# EAGLE board pcDuino3c_MB (EAGLE 7.2.0), part 1 of 2
pcDuino3C Base Board
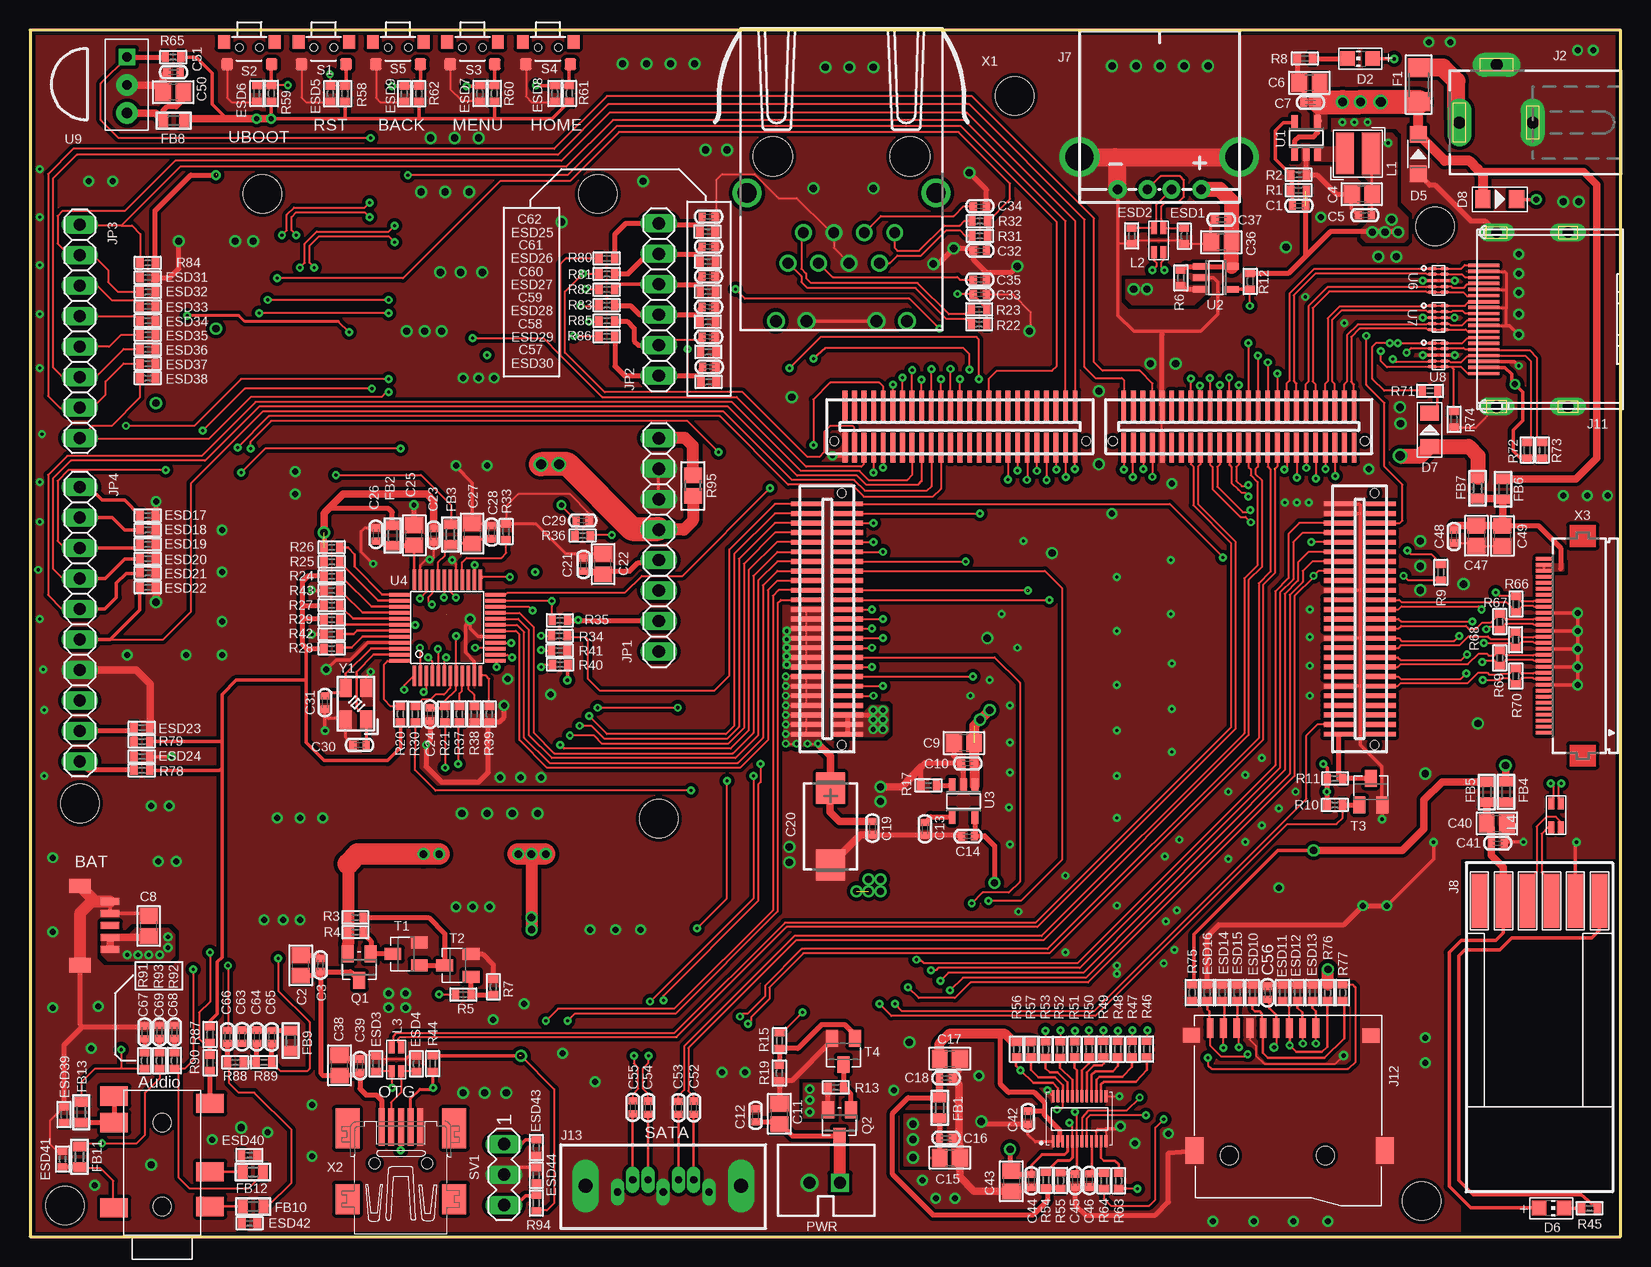
[diagram p8: board, top side]
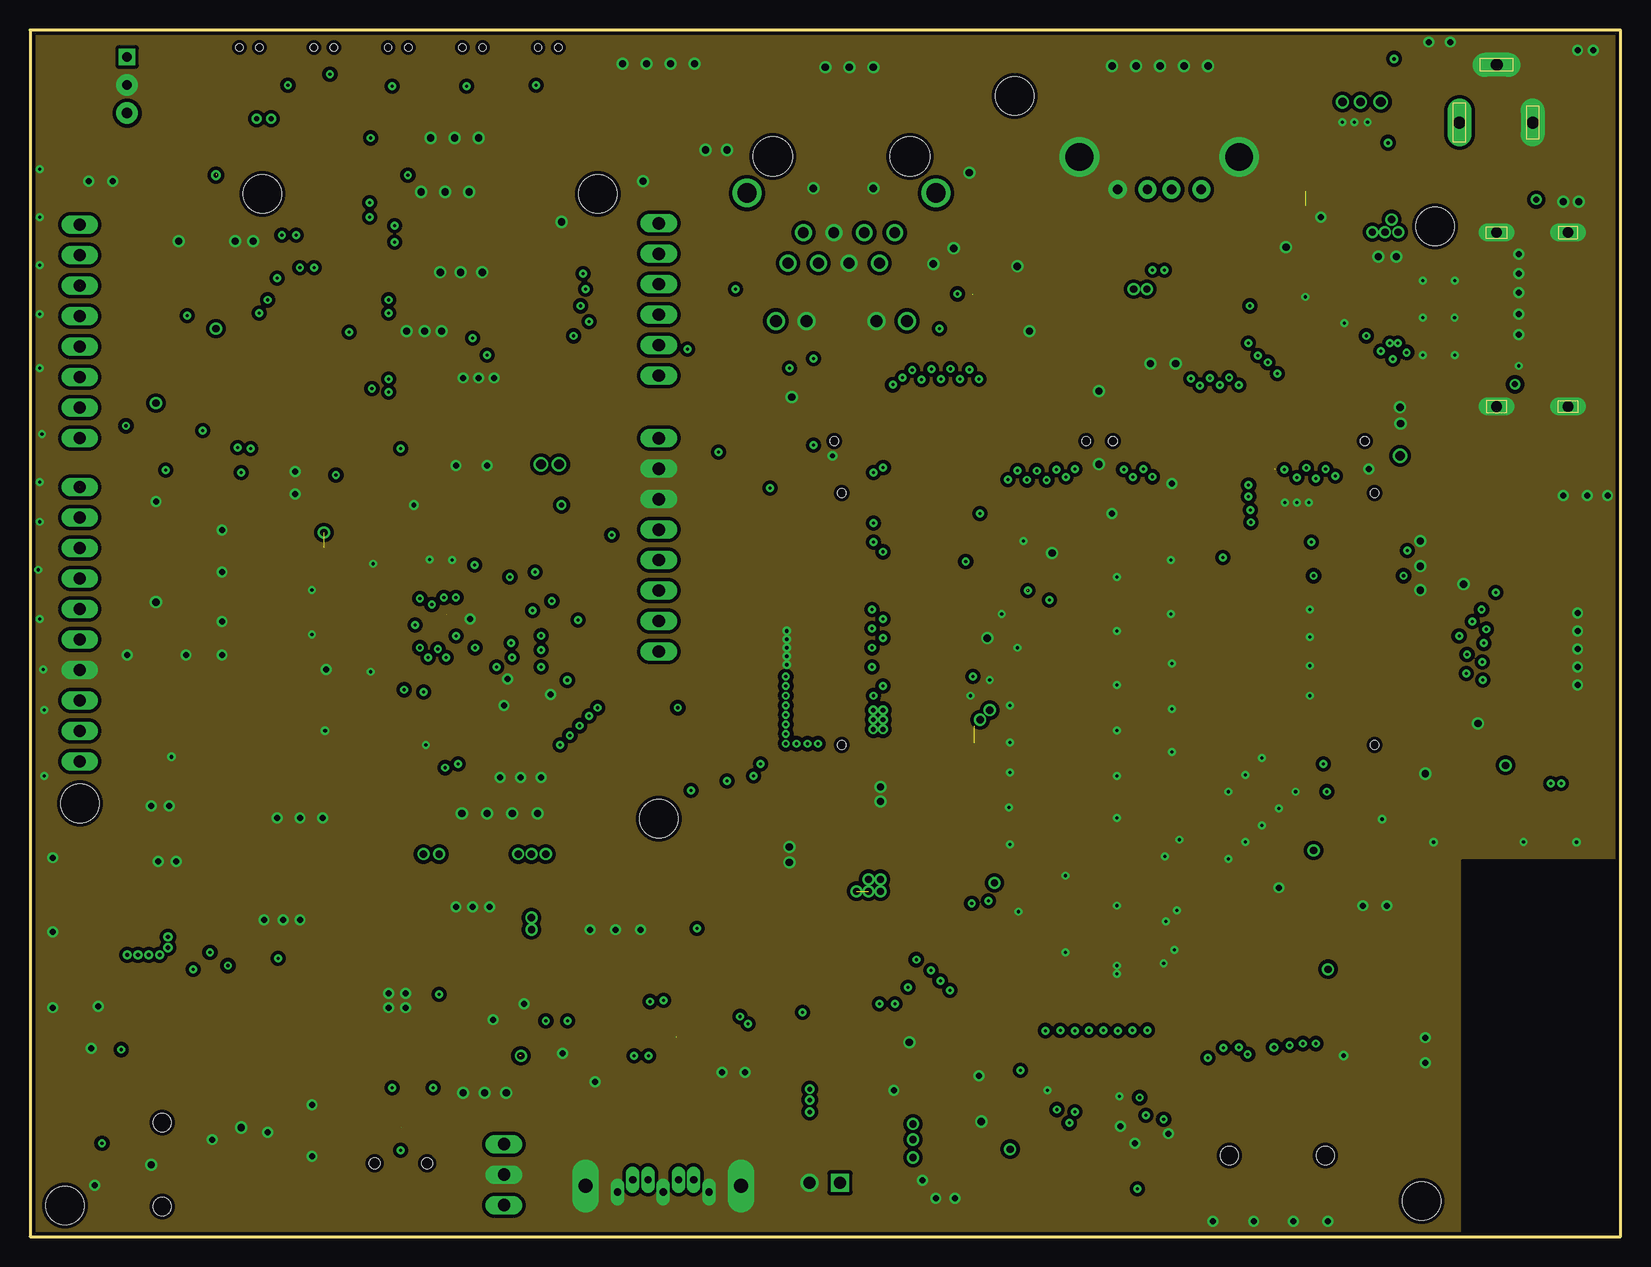
[diagram p9: board, inner layer GND]
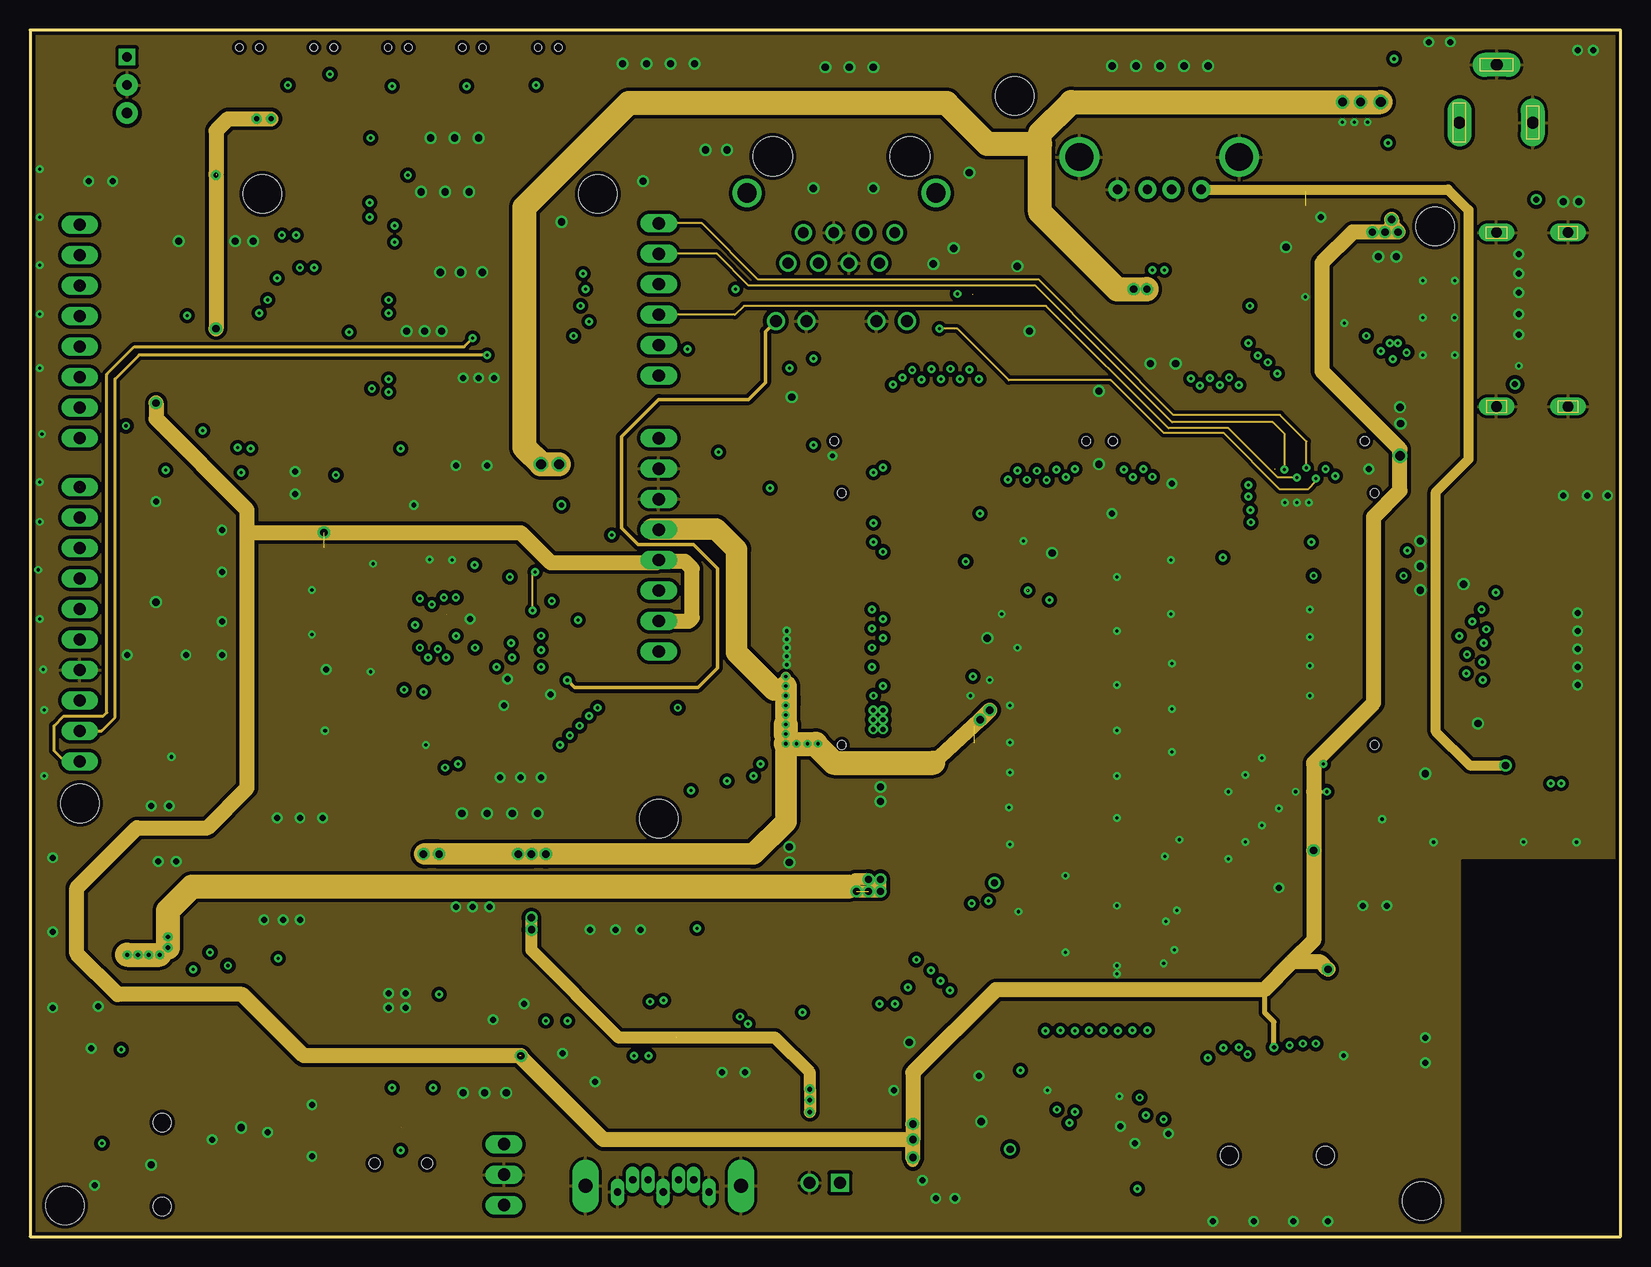
[diagram p10: board, inner layer VCC]
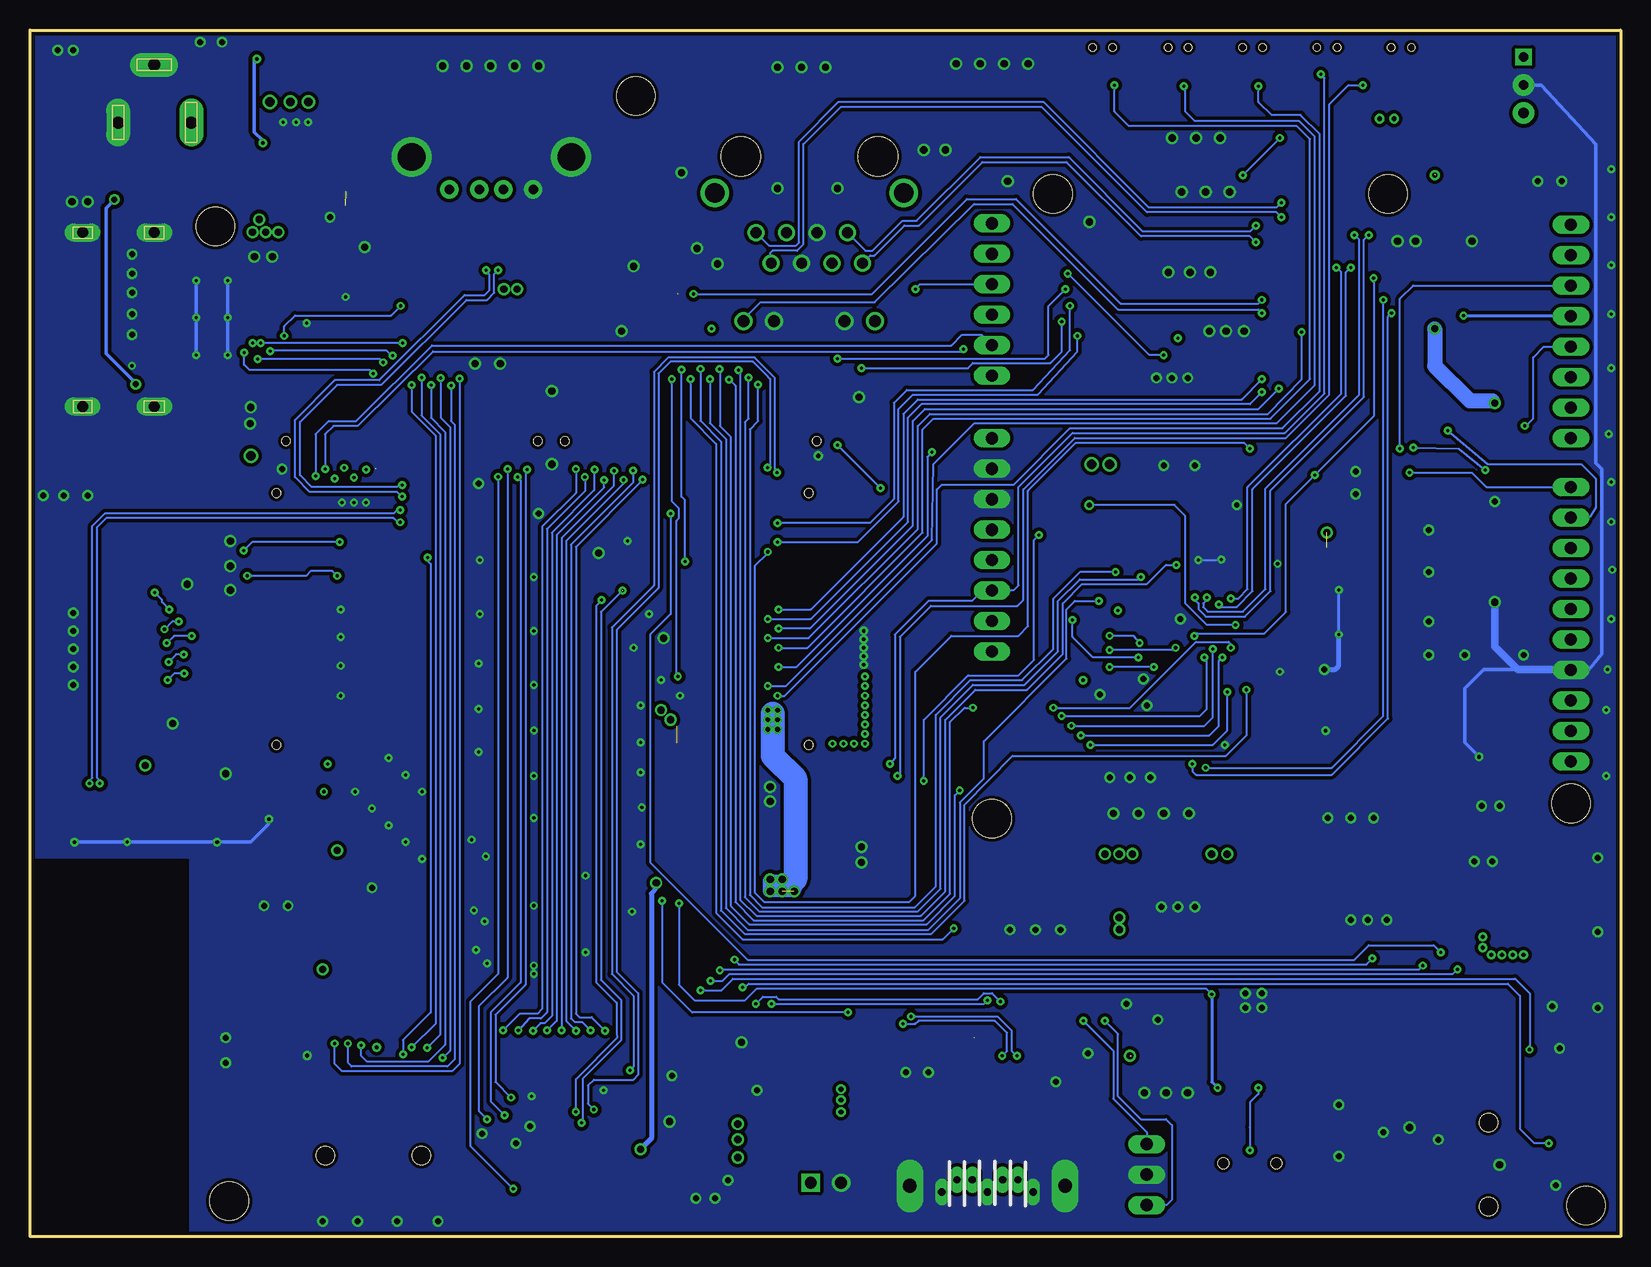
[diagram p11: board, bottom side, seen from below]

Size 132.6 x 100.6 mm. Coordinates in mm from the lower left corner, seen from the top.
Outline: 0,0 132.6,0 132.6,100.6 0,100.6 0,0
Copper layers (1+2*3+16): Top 0.035mm / dielectric 1.5mm / GND 0.035mm / dielectric 0.15mm / VCC 0.035mm / dielectric 0.2mm / Bottom 0.035mm
Design rules "default *": minimum track width 0.15mm, minimum drill 10mil, track to track 4mil, track to pad 4mil, pad to pad 4mil, via to via 4mil, smd to smd 0mil, copper to edge 5mil, drill to drill 5mil, minimum pad ring 10mil, minimum via ring 8mil, stop-mask expansion 1mil, vias tented up to drill 10mil, thermal gap 10mil
Net classes: 0 default: clearance 0.205 mm; 1 GND: width 0.406 mm, drill 0.61 mm, clearance 0.203 mm to class 0; 2 DC_5V: width 0.406 mm, drill 0.61 mm, clearance 0.203 mm to class 0, clearance 0.203 mm to class 1
Holes 3.2 mm at 19.39,86.92 47.33,86.92 4.15,36.12 52.41,34.85 2.9,2.6 82.09,95.09 117.13,84.22 116,2.98
Milling: 16 lines

## Footprints (pad centres in the part's own frame; a part is rotated, then mirrored left to right if it is on the bottom)
C0402K = smd 0.6 x 0.7: 1 -0.55,0; 2 0.55,0
C0805 = smd 1.3 x 1.5: 1 -0.85,0; 2 0.85,0
CT7343 = smd 2.6 x 2.4: + 3.2,0; - -3.2,0
CHIP-LED-0805 = smd 1.2 x 1.2: A 1.27,-1.05; C 1.27,1.05
SOD123 = smd 1.397 x 1.397: + 1.651,0; - -1.651,0
D1206 = smd 1.27 x 1.524: + -1.397,0; - 1.397,0
R0402 = smd 0.6 x 0.8: 1 -0.65,0; 2 0.65,0
R1206 = smd 1.6 x 1.803: 1 -1.422,0; 2 1.422,0
R0603 = smd 0.8 x 1.1: 1 -0.85,0; 2 0.85,0
CON-BAT-5P-1MM = smd 0.6 x 1.55: 1 0,0; 2 1,0; 3 2,0; 4 3,0; 5 4,0 | smd 1.2 x 1.8: 6 -1.3,2.525; 7 5.3,2.525
DCJ0202 = drill 1 pad 2 long: 1 0,3.1; 2 4.8,0; 3 0,-3
BTB-50PIN-0.8 = smd 0.4 x 2.5: 1 0,0; 2 -0.8,0; 3 -1.6,0; 4 -2.4,0; 5 -3.2,0; 6 -4,0; 7 -4.8,0; 8 -5.6,0; 9 -6.4,0; 10 -7.2,0; 11 -8,0; 12 -8.8,0; 13 -9.6,0; 14 -10.4,0; 15 -11.2,0; 16 -12,0; 17 -12.8,0; 18 -13.6,0; 19 -14.4,0; 20 -15.2,0; 21 -16,0; 22 -16.8,0; 23 -17.6,0; 24 -18.4,0; 25 -19.2,0; 26 -19.2,3.5; 27 -18.4,3.5; 28 -17.6,3.5; 29 -16.8,3.5; 30 -16,3.5; 31 -15.2,3.5; 32 -14.4,3.5; 33 -13.6,3.5; 34 -12.8,3.5; 35 -12,3.5; 36 -11.2,3.5; 37 -10.4,3.5; 38 -9.6,3.5; 39 -8.8,3.5; 40 -8,3.5; 41 -7.2,3.5; 42 -6.4,3.5; 43 -5.6,3.5; 44 -4.8,3.5; 45 -4,3.5; 46 -3.2,3.5; 47 -2.4,3.5; 48 -1.6,3.5; 49 -0.8,3.5; 50 0,3.5 | hole 0.7: -20.1,0.528; 0.9,0.528
CON-USB = drill 0.787 pad 1.524: 1 -3.632,4.623; 2 -1.143,4.623; 3 0.864,4.623; 4 3.353,4.623 | drill 2.311 pad 2.794: 5 -6.782,1.905; 6 6.528,1.905
PCDUINO-WIFI-0_1PRIMARY = smd 1.295 x 4.496: 1 -5.867,-7.899; 2 -3.861,-7.899; 3 -1.88,-7.899; 4 0.127,-7.899; 5 2.134,-7.899; 6 4.14,-7.899
AXK824145WG = smd 0.23 x 1: P$1 0,-1.88; P$2 0,1.88; P$3 0.4,-1.88; P$4 0.4,1.88; P$5 0.8,-1.88; P$6 0.8,1.88; P$7 1.2,-1.88; P$8 1.2,1.88; P$9 1.6,-1.88; P$10 1.6,1.88; P$11 2,-1.88; P$12 2,1.88; P$13 2.4,-1.88; P$14 2.4,1.88; P$15 2.8,-1.88; P$16 2.8,1.88; P$17 3.2,-1.88; P$18 3.2,1.88; P$19 3.6,-1.88; P$20 3.6,1.88; P$21 4,-1.88; P$22 4,1.88; P$23 4.4,-1.88; P$24 4.4,1.88
CON-HDMI = smd 0.279 x 2.591: 1 4.14,4.877; 2 3.632,4.877; 3 3.124,4.877; 4 2.642,4.877; 5 2.134,4.877; 6 1.626,4.877; 7 1.118,4.877; 8 0.635,4.877; 9 0.127,4.877; 10 -0.381,4.877; 11 -0.864,4.877; 12 -1.372,4.877; 13 -1.88,4.877; 14 -2.362,4.877; 15 -2.87,4.877; 16 -3.378,4.877; 17 -3.861,4.877; 18 -4.369,4.877; 19 -4.877,4.877 | drill 0.889 pad 1.499 long: P$1 -7.62,3.81; P$2 6.883,3.81; P$3 -7.62,-2.159; P$4 6.883,-2.159
SOCKET-MICROSD = smd 0.56 x 1.6: 1 -4.25,-7.35; 2 -3.15,-7.35; 3 -2.05,-7.35; 4 -0.95,-7.35; 5 0.15,-7.35; 6 1.25,-7.35; 7 2.35,-7.35; 8 3.45,-7.35; 9 4.55,-7.35 | smd 1.4 x 1.2: 10 6.125,-6.75; 11 -8.85,-6.725 | smd 1.5 x 2.2: 12 5.85,2.875; 13 -10,2.875 | hole 1.5: -5.05,3.275; 2.95,3.275
CON-SATA = drill 0.6 pad 0.8 long: 1 10.287,-0.508; 2 9.017,0.508; 3 7.747,0.508; 4 6.477,-0.508; 5 5.207,0.508; 6 3.937,0.508; 7 2.667,-0.508 | drill 1.143 pad 2.21 long: 8 0,0; 9 12.954,0
PJ-342B = smd 1.6 x 2.3: 2 -2.4,4; 3 -2.3,-4; 4 -5.3,4; 5 -9.4,-4; 6 -11,4; 7 -11.6,-4 | hole 1.5: -2.4,0; -9.4,0
1X08 = drill 1.016 long: 1 -8.89,0; 2 -6.35,0; 3 -3.81,0; 4 -1.27,0; 5 1.27,0; 6 3.81,0; 7 6.35,0; 8 8.89,0
1X06 = drill 1.016 long: 1 -6.35,0; 2 -3.81,0; 3 -1.27,0; 4 1.27,0; 5 3.81,0; 6 6.35,0
1X10 = drill 1.016 long: 1 -11.43,0; 2 -8.89,0; 3 -6.35,0; 4 -3.81,0; 5 -1.27,0; 6 1.27,0; 7 3.81,0; 8 6.35,0; 9 8.89,0; 10 11.43,0
L_CD32 = smd 3.454 x 1.524: 1 0,1.092; 2 0,-1.092
CL-2M2012 = smd 1 x 0.5: 1 -1,0.4; 2 -1,-0.4; 3 1,-0.4; 4 1,0.4
PWR2P_2.54 = drill 0.991 pad 1.524 square: 1 -1.27,0 | drill 0.991 pad 1.524: 2 1.27,0
SOT23 = smd 1 x 1.4: 1 -0.95,-1.1; 2 0.95,-1.1; 3 0,1.1
R0805 = smd 1.3 x 1.5: 1 -0.85,0; 2 0.85,0
KEY = smd 0.991 x 0.991: 1 -1.854,-1.397; 2 1.854,-1.397 | smd 0.991 x 1.092: 3 -2.108,0.457; 4 2.108,0.457 | hole 0.6: 0.838,0; -0.838,0
MA03-1 = drill 1.016 long: 1 -2.54,0; 2 0,0; 3 2.54,0
SOT23-BEC = smd 1 x 1.4: B -0.95,-1.1; C 0,1.1; E 0.95,-1.1
SOT23-5 = smd 0.55 x 1.2: 1 -0.95,-1.3; 2 0,-1.3; 3 0.95,-1.3; 4 0.95,1.3; 5 -0.95,1.3
LQFP48-7X7 = smd 1.7 x 0.3: 1 0,0; 2 0,-0.5; 3 0,-1; 4 0,-1.5; 5 0,-2; 6 0,-2.5; 7 0,-3; 8 0,-3.5; 9 0,-4; 10 0,-4.5; 11 0,-5; 12 0,-5.5; 25 8,-5.5; 26 8,-5; 27 8,-4.5; 28 8,-4; 29 8,-3.5; 30 8,-3; 31 8,-2.5; 32 8,-2; 33 8,-1.5; 34 8,-1; 35 8,-0.5; 36 8,0 | smd 0.3 x 1.7: 13 1.25,-6.75; 14 1.75,-6.75; 15 2.25,-6.75; 16 2.75,-6.75; 17 3.25,-6.75; 18 3.75,-6.75; 19 4.25,-6.75; 20 4.75,-6.75; 21 5.25,-6.75; 22 5.75,-6.75; 23 6.25,-6.75; 24 6.75,-6.75; 37 6.75,1.25; 38 6.25,1.25; 39 5.75,1.25; 40 5.25,1.25; 41 4.75,1.25; 42 4.25,1.25; 43 3.75,1.25; 44 3.25,1.25; 45 2.75,1.25; 46 2.25,1.25; 47 1.75,1.25; 48 1.25,1.25
RCLAMP0524P_1PRIMARY = smd 0.305 x 0.787: 1 -0.991,-0.508; 2 -0.508,-0.508; 3 0,-0.508; 4 0.508,-0.508; 5 0.991,-0.508; 6 0.991,0.508; 7 0.508,0.508; 8 0,0.508; 9 -0.508,0.508; 10 -0.991,0.508
HS/VS1838 = drill 0.8 pad 1.383 square: 1 -2.337,0 | drill 0.8 pad 1.803: 2 0,0 | drill 0.889 pad 1.803: 3 2.337,0
J1 = drill 0.9 pad 1.3: 1 4.445,2.54; 2 3.175,0; 3 1.905,2.54; 4 0.635,0; 5 -0.635,2.54; 6 -1.905,0; 7 -3.175,2.54; 8 -4.445,0 | drill 1 pad 1.422: 9 5.465,7.37; 10 2.925,7.37; 11 -2.925,7.37; 12 -5.465,7.37 | drill 1.6 pad 2.184: M1 -7.875,-3.3; M2 7.875,-3.3 | hole 3.3: 5.715,-6.35; -5.715,-6.35
32005-201 = smd 3.1 x 0.5: 1 3,1.6; 2 3,0.8; 3 3,0; 4 3,-0.8; 5 3,-1.6 | smd 2.5 x 2: M1 -3,-4.45; M2 -3,4.45 | smd 3.3 x 2: M3 2.9,4.45; M4 2.9,-4.45 | hole 0.9: 0,2.2; 0,-2.2
FH12-30S-0.5SH = smd 0.3 x 1.3: 1 -7.25,3.25; 2 -6.75,3.25; 3 -6.25,3.25; 4 -5.75,3.25; 5 -5.25,3.25; 6 -4.75,3.25; 7 -4.25,3.25; 8 -3.75,3.25; 9 -3.25,3.25; 10 -2.75,3.25; 11 -2.25,3.25; 12 -1.75,3.25; 13 -1.25,3.25; 14 -0.75,3.25; 15 -0.25,3.25; 16 0.25,3.25; 17 0.75,3.25; 18 1.25,3.25; 19 1.75,3.25; 20 2.25,3.25; 21 2.75,3.25; 22 3.25,3.25; 23 3.75,3.25; 24 4.25,3.25; 25 4.75,3.25; 26 5.25,3.25; 27 5.75,3.25; 28 6.25,3.25; 29 6.75,3.25; 30 7.25,3.25
NX3225 = smd 1.499 x 0.991: 1 -1.325,-0.81; 2 1.266,-0.81; 3 1.266,0.891; 4 -1.325,0.891

## Placement (x,y rotation side)
C1  47pF  [C0402K]  105.78,85.96 180 top
C2  10uF  [C0805]  22.57,22.62 90 top
C3  100nF  [C0402K]  24.21,22.65 90 top
C4  10uF  [C0805]  111.01,86.91 180 top
C5  100nF  [C0402K]  111.27,85.16 180 top
C6  10uF  [C0805]  106.65,96.19 180 top
C7  100nF  [C0402K]  106.74,94.56 180 top
C8  10uF  [C0805]  9.9,25.9 90 top
C9  100nF  [C0805]  77.85,41.15 180 top
C10  1uF  [C0402K]  78.17,39.45 180 top
C11  22uF/16V  [C0805]  62.47,10.24 90 top
C12  100nF  [C0402K]  60.49,10.12 90 top
C13  22nF  [C0402K]  74.6,34 270 top
C14  1uF  [C0402K]  78.19,33.39 180 top
C15  1uF  [C0805]  76.67,6.59 0 top
C16  100nF  [C0402K]  76.37,8.23 0 top
C17  1uF  [C0805]  76.67,14.85 0 top
C18  100nF  [C0402K]  76.37,13.22 0 top
C19  100nF  [C0402K]  70.22,34.06 270 top
C20  4.7uF  [CT7343]  66.73,34.2 90 top
C21  100nF  [C0402K]  46.14,56.04 90 top
C22  10uF  [C0805]  47.77,56.08 90 top
C23  100nF  [C0402K]  33.65,58.49 270 top
C24  100nF  [C0402K]  33.34,43.55 270 top
C25  10uF  [C0805]  32.03,58.48 90 top
C26  100nF  [C0402K]  28.83,58.55 90 top
C27  10uF  [C0805]  36.85,58.62 270 top
C28  100nF  [C0402K]  38.47,58.74 90 top
C29  1uF  [C0402K]  46.07,59.7 180 top
C30  18pF  [C0402K]  27.47,40.99 180 top
C31  18pF  [C0402K]  24.58,44.53 270 top
C32  100nF  [C0402K]  79.18,82.22 0 top
C33  100nF  [C0402K]  79.17,78.56 180 top
C34  100nF  [C0402K]  79.18,85.9 180 top
C35  100nF  [C0402K]  79.17,79.78 180 top
C36  10uF  [C0805]  99.3,82.9 180 top
C37  100nF  [C0402K]  99.3,84.8 180 top
C38  10uF  [C0805]  25.8,14.29 90 top
C39  100nF  [C0402K]  27.5,14.26 90 top
C40  100nF  [C0805]  122.28,34.45 0 top
C41  10uF  [C0402K]  122.35,32.81 0 top
C42  100nF  [C0402K]  83.19,9.93 270 top
C43  1uF  [C0805]  81.8,4.62 270 top
C44  100nF  [C0402K]  83.47,4.66 90 top
C45  1uF  [C0402K]  87.12,4.68 90 top
C46  22pF/NC  [C0402K]  88.32,4.69 90 top
C47  22uF  [C0805]  120.57,58.44 270 top
C48  100pF  [C0402K]  118.7,58.37 270 top
C49  100nF  [C0805]  122.74,58.42 270 top
C50  100nF  [C0805]  11.94,95.41 180 top
C51  100nF  [C0402K]  11.97,97.07 180 top
C52  10pF  [C0402K]  55.33,10.76 270 top
C53  10pF  [C0402K]  54.05,10.75 270 top
C54  10pF  [C0402K]  51.53,10.76 270 top
C55  10pF  [C0402K]  50.25,10.79 270 top
C56  100nF  [C0402K]  103.16,20.34 270 top
C57  33pF  [C0402K]  56.62,72.51 0 top
C58  33pF  [C0402K]  56.57,75.01 0 top
C59  33pF  [C0402K]  56.57,77.51 0 top
C60  33pF  [C0402K]  56.57,80.06 0 top
C61  33pF  [C0402K]  56.57,82.54 0 top
C62  33pF  [C0402K]  56.57,85.04 0 top
C63  4.7uF  [C0402K]  17.68,16.67 270 top
C64  4.7uF  [C0402K]  18.91,16.67 270 top
C65  100nF  [C0402K]  20.15,16.65 270 top
C66  100nF  [C0402K]  16.46,16.66 90 top
C67  100nF  [C0402K]  9.55,17.05 90 top
C68  100nF  [C0402K]  12.04,17.07 90 top
C69  100nF  [C0402K]  10.79,17.06 90 top
D2  LED  [CHIP-LED-0805]  110.88,96.94 90 top
D5  MMSZ5232B  [SOD123]  115.73,90.25 270 top
D6  [CHIP-LED-0805]  126.83,3.65 270 top
D7  XBS104S14  [D1206]  116.67,67.27 90 top
D8  XBS104S14  [D1206]  122.51,86.49 0 top
ESD1  ESDPSA0402V05  [R0402]  96.22,83.42 90 top
ESD2  ESDPSA0402V05  [R0402]  91.84,83.43 90 top
ESD3  ESDPSA0402V05  [R0402]  28.84,14.42 270 top
ESD4  ESDPSA0402V05  [R0402]  32.21,14.42 270 top
ESD5  ESDPSA0402V05  [R0402]  25.04,95.29 90 top
ESD6  ESDPSA0402V05  [R0402]  18.9,95.3 90 top
ESD7  ESDPSA0402V05  [R0402]  37.5,95.3 90 top
ESD8  ESDPSA0402V05  [R0402]  43.75,95.3 90 top
ESD9  ESDPSA0402V05  [R0402]  31.2,95.29 90 top
ESD10  ESDPSA0402V05  [R0402]  101.9,20.34 270 top
ESD11  ESDPSA0402V05  [R0402]  104.4,20.34 270 top
ESD12  ESDPSA0402V05  [R0402]  105.65,20.34 270 top
ESD13  ESDPSA0402V05  [R0402]  106.9,20.34 270 top
ESD14  ESDPSA0402V05  [R0402]  99.38,20.34 270 top
ESD15  ESDPSA0402V05  [R0402]  100.63,20.34 270 top
ESD16  ESDPSA0402V05  [R0402]  98.13,20.34 270 top
ESD17  ESDPSA0402V05  [R0402]  9.81,60.12 180 top
ESD18  ESDPSA0402V05  [R0402]  9.81,58.92 180 top
ESD19  ESDPSA0402V05  [R0402]  9.81,57.72 180 top
ESD20  ESDPSA0402V05  [R0402]  9.81,56.52 180 top
ESD21  ESDPSA0402V05  [R0402]  9.81,55.34 180 top
ESD22  ESDPSA0402V05  [R0402]  9.81,54.14 180 top
ESD23  ESDPSA0402V05  [R0402]  9.32,42.44 180 top
ESD24  ESDPSA0402V05  [R0402]  9.32,40.04 180 top
ESD25  ESDPSA0402V05  [R0402]  56.48,83.79 180 top
ESD26  ESDPSA0402V05  [R0402]  56.49,81.29 180 top
ESD27  ESDPSA0402V05  [R0402]  56.5,78.79 180 top
ESD28  ESDPSA0402V05  [R0402]  56.49,76.26 180 top
ESD29  ESDPSA0402V05  [R0402]  56.55,73.76 180 top
ESD30  ESDPSA0402V05  [R0402]  56.56,71.26 180 top
ESD31  ESDPSA0402V05  [R0402]  9.81,79.96 180 top
ESD32  ESDPSA0402V05  [R0402]  9.81,78.76 180 top
ESD33  ESDPSA0402V05  [R0402]  9.81,77.56 180 top
ESD34  ESDPSA0402V05  [R0402]  9.81,76.36 180 top
ESD35  ESDPSA0402V05  [R0402]  9.81,75.18 180 top
ESD36  ESDPSA0402V05  [R0402]  9.81,73.98 180 top
ESD37  ESDPSA0402V05  [R0402]  9.81,72.78 180 top
ESD38  ESDPSA0402V05  [R0402]  9.81,71.58 180 top
ESD39  ESDPSA0402V05  [R0402]  2.84,10.18 270 top
ESD40  ESDPSA0402V05  [R0402]  18.3,6.8 180 top
ESD41  ESDPSA0402V05  [R0402]  2.72,6.47 270 top
ESD42  ESDPSA0402V05  [R0402]  18.31,1.12 180 top
ESD43  ESDPSA0402V05  [R0402]  42.21,7.44 90 top
ESD44  ESDPSA0402V05  [R0402]  42.2,5.12 270 top
F1  2A_SMD  [R1206]  115.77,96.04 90 top
FB1  47R@500mA  [R0603]  75.82,10.74 90 top
FB2  47R@500mA  [R0603]  30.23,58.46 90 top
FB3  47R@500mA  [R0603]  35.05,58.55 270 top
FB4  47R@500mA  [R0603]  123.04,37.07 90 top
FB5  47R@500mA / NC  [R0603]  121.44,37.06 90 top
FB6  47R@500mA  [R0603]  122.79,62.31 90 top
FB7  NC  [R0603]  120.65,62.39 90 top
FB8  LI0603EXXXR-10  [R0603]  11.97,93.04 180 top
FB9  120  [R0603]  21.73,16.35 90 top
FB10  120  [R0603]  18.6,2.52 0 top
FB11  120  [R0603]  4.14,6.67 90 top
FB12  120  [R0603]  18.58,5.4 0 top
FB13  120  [R0603]  4.27,10.38 90 top
J1  CON-BAT  [CON-BAT-5P-1MM]  6.68,23.95 90 top
J2  DCJ0202  [DCJ0202]  122.25,92.89 90 top
J3  BTB-50PIN-0.8-1  [BTB-50PIN-0.8]  68.21,61.1 90 top
J4  [BTB-50PIN-0.8]  112.6,61.1 90 top
J5  [BTB-50PIN-0.8]  87.13,65.8 0 top
J7  CON-USB  [CON-USB]  94.01,91.92 180 top
J8  RTL8188CUS  [PCDUINO-WIFI-0_1PRIMARY]  124.96,20.09 180 top
J10  Q1S02B  [AXK824145WG]  85.29,9.82 0 top
J11  CON-HDMI  [CON-HDMI]  126.05,76.83 90 top
J12  SOCKET-MICROSD  [SOCKET-MICROSD]  102.93,10.05 180 top
J13  CON-SATA  [CON-SATA]  46.31,4.24 0 top
J14  PJ-342B  [PJ-342B]  11.01,0.12 270 top
J15  BTB-50PIN-0.8-4  [BTB-50PIN-0.8]  110.37,65.8 0 top
JP1  [1X08]  52.41,57.67 90 top
JP2  [1X06]  52.41,78.13 90 top
JP3  [1X08]  4.15,75.47 270 top
JP4  [1X10]  4.15,51.05 270 top
L1  4.7uH/1.5A  [L_CD32]  110.69,90.29 270 top
L2  IND-CL-2M2012  [CL-2M2012]  94.08,83.07 90 top
L3  IND-CL-2M2012  [CL-2M2012]  30.53,14.77 270 top
L4  IND-CL-2M2012  [CL-2M2012]  127.2,35.14 270 top
PWR  PWR2P_90  [PWR2P_2.54]  66.25,4.5 180 top
Q1  AO3401  [SOT23]  27.44,22.47 180 top
Q2  AO3401  [SOT23]  67.47,9.49 180 top
R1  100K/1%  [R0402]  105.74,87.24 0 top
R2  22K/1%  [R0402]  105.75,88.53 0 top
R3  47K  [R0402]  27.13,26.61 0 top
R4  47K  [R0402]  27.13,25.39 0 top
R5  100K  [R0402]  36.12,20.18 0 top
R6  0R/NC  [R0402]  95.93,79.93 90 top
R7  47K  [R0402]  38.62,20.83 270 top
R8  1K  [R0402]  106.27,98.23 0 top
R9  0R  [R0402]  117.6,55.4 90 top
R10  10K  [R0402]  108.77,36 180 top
R11  510R  [R0402]  108.79,38.2 180 top
R12  10K  [R0402]  101.72,79.64 90 top
R13  47K  [R0402]  67.16,12.45 180 top
R15  10K  [R0402]  62.48,16.35 90 top
R17  10K  [R0402]  74.9,37.62 0 top
R19  47K  [R0402]  62.47,13.64 90 top
R20  10K  [R0402]  30.89,43.57 90 top
R21  0R  [R0402]  34.57,43.56 270 top
R22  49.9R/1%  [R0402]  79.13,76.08 180 top
R23  49.9R/1%  [R0402]  79.13,77.31 180 top
R24  10K  [R0402]  25.15,55.06 180 top
R25  10K  [R0402]  25.15,56.26 180 top
R26  10K  [R0402]  25.15,57.47 180 top
R27  10K  [R0402]  25.15,52.65 180 top
R28  10K  [R0402]  25.15,49.03 180 top
R29  100K  [R0402]  25.15,51.43 180 top
R30  100R  [R0402]  32.11,43.56 90 top
R31  49.9R/1%  [R0402]  79.18,83.43 180 top
R32  49.9R/1%  [R0402]  79.18,84.67 180 top
R33  6.2K/1%  [R0402]  39.68,58.78 90 top
R34  100R  [R0402]  44.14,50.09 180 top
R35  10K  [R0402]  44.16,51.38 0 top
R36  0R / NC  [R0402]  46.06,58.45 180 top
R37  1K  [R0402]  35.8,43.57 90 top
R38  10K  [R0402]  37.03,43.57 90 top
R39  10K  [R0402]  38.29,43.57 90 top
R40  1K  [R0402]  44.19,47.7 180 top
R41  10K  [R0402]  44.14,48.87 180 top
R42  10K  [R0402]  25.15,50.23 0 top
R43  10k  [R0402]  25.15,53.87 0 top
R44  4.7K  [R0402]  33.56,14.43 90 top
R45  510R  [R0402]  129.99,2.37 180 top
R46  22R  [R0402]  93.09,15.64 270 top
R47  22R  [R0402]  91.89,15.63 270 top
R48  22R  [R0402]  90.68,15.63 270 top
R49  22R  [R0402]  89.48,15.64 270 top
R50  22R  [R0402]  88.28,15.63 270 top
R51  22R  [R0402]  87.07,15.62 270 top
R52  22R  [R0402]  85.86,15.61 270 top
R53  22R  [R0402]  84.66,15.61 270 top
R54  10K  [R0402]  84.69,4.71 270 top
R55  100K  [R0402]  85.91,4.69 270 top
R56  10K  [R0402]  82.24,15.62 270 top
R57  10K  [R0402]  83.45,15.62 270 top
R58  10K  [R0402]  26.25,95.29 270 top
R59  10K  [R0402]  20.12,95.3 270 top
R60  10K  [R0402]  38.71,95.3 270 top
R61  10K  [R0402]  44.97,95.3 270 top
R62  10K  [R0402]  32.42,95.29 270 top
R63  22R  [R0402]  90.74,4.66 90 top
R64  22R  [R0402]  89.52,4.66 90 top
R65  4.7K  [R0402]  11.93,98.34 180 top
R66  100R/NC  [R0402]  123.88,52.74 90 top
R67  100R/NC  [R0402]  122.52,51.28 90 top
R68  100R/NC  [R0402]  123.84,49.77 90 top
R69  100R/NC  [R0402]  122.52,48.25 90 top
R70  100R/NC  [R0402]  123.85,46.74 90 top
R71  10K  [R0402]  116.71,70.52 0 top
R72  2.2K  [R0402]  124.8,65.57 270 top
R73  2.2K  [R0402]  126.06,65.57 270 top
R74  47K  [R0402]  118.7,68.14 90 top
R75  47K  [R0402]  96.87,20.34 270 top
R76  47K  [R0402]  108.17,20.34 270 top
R77  33R  [R0402]  109.42,20.34 90 top
R78  2.2K  [R0402]  9.32,38.88 0 top
R79  2.2K  [R0402]  9.32,41.28 0 top
R80  0R/NC  [R0402]  48.07,81.56 0 top
R81  0R/NC  [R0402]  48.07,80.26 0 top
R82  0R/NC  [R0402]  48.07,78.96 0 top
R83  0R/NC  [R0402]  48.07,77.66 0 top
R84  2.2K  [R0402]  9.81,81.18 0 top
R85  0R/NC  [R0402]  48.07,76.36 0 top
R86  0R/NC  [R0402]  48.07,75.06 0 top
R87  100K  [R0402]  15.01,16.84 270 top
R88  10K  [R0402]  17.11,14.54 180 top
R89  10k  [R0402]  19.5,14.55 180 top
R90  10K  [R0402]  15.01,14.5 270 top
R91  22R  [R0402]  9.55,14.67 90 top
R92  22R  [R0402]  12.04,14.68 90 top
R93  22R  [R0402]  10.79,14.67 90 top
R94  10K  [R0402]  42.2,2.8 90 top
R95  0R  [R0805]  55.27,62.62 90 top
S1  SMD_KEY  [KEY]  24.49,99.14 0 top
S2  SMD_KEY  [KEY]  18.29,99.14 0 top
S3  SMD_KEY  [KEY]  36.89,99.14 0 top
S4  SMD_KEY  [KEY]  43.19,99.14 0 top
S5  SMD_KEY  [KEY]  30.69,99.14 0 top
SV1  [MA03-1]  39.51,5.18 270 top
T1  MMBT3904  [SOT23-BEC]  31.35,23.57 90 top
T2  MMBT3904  [SOT23-BEC]  35.67,22.62 90 top
T3  MMBT3904  [SOT23-BEC]  111.77,37.1 0 top
T4  MMBT3904  [SOT23-BEC]  67.81,15.45 180 top
U1  SY8088  [SOT23-5]  106.38,91.59 0 top
U2  RT9701GB  [SOT23-5]  98.85,79.94 270 top
U3  RT9193GB  [SOT23-5]  77.82,36.32 180 top
U4  IP101ALF  [LQFP48-7X7]  32.03,46.78 90 top
U6  SEDFN05V4  [RCLAMP0524P_1PRIMARY]  117.41,79.72 270 top
U7  SEDFN05V4  [RCLAMP0524P_1PRIMARY]  117.41,76.62 270 top
U8  SEDFN05V4  [RCLAMP0524P_1PRIMARY]  117.41,73.51 270 top
U9  INFARED  [HS/VS1838]  8.09,96.01 270 top
X1  J1011F01P  [J1]  67.64,83.71 180 top
X2  MINI-USB-32005-201  [32005-201]  30.92,6.14 90 top
X3  FH12-30S-0.5SH  [FH12-30S-0.5SH]  129.44,49.26 90 top
Y1  25MHz  [NX3225]  27.22,44.46 90 top

## Tracks (layer width: path | path; a pad name or v marks a point on that pad's centre or on a via)
ADC_2  (via drill 0.25)
  Top 0.15: J15.7 105.6,65.77 v105.6,63.3
  Top 0.406: R83.2 48.76,77.62 50.07,77.62 50.83,76.86 JP2.3 55.84,76.87 | C59.1 55.84,77.33 55.84,76.87 | 55.84,76.87 ESD28.2 55.78,76.32 55.77,76.32
  VCC 0.15: v105.6,63.3 104,63.3 99.9,67.4 94.9,67.4 84.7,77.6 59.5,77.6 58.76,76.86 JP2.3
ADC_3  (via drill 0.25)
  Top 0.15: J15.5 107.2,65.77 v107.2,63.2 | v75.8,75.7 73.3,78.2 59.6,78.2 v58.8,79
  Top 0.305: JP2.4 49.16,79.4 R82.2
  Top 0.406: R82.2 | C60.1 55.85,79.89 55.85,79.37 | 55.85,79.37 ESD27.2 55.75,78.79 | JP2.4 52.44,79.37 55.85,79.37
  VCC 0.15: v107.2,63.2 107.2,63 106.5,62.3 104.2,62.3 99.5,67 94.5,67 90.1,71.4 81.6,71.4 77.3,75.7 v75.8,75.7
  Bottom 0.15: v58.8,79 58.4,79.4 JP2.4
ADC_4  (via drill 0.25)
  Top 0.15: v104.57,63.97 104.8,64.2 104.8,65.77 J15.8
  Top 0.406: R81.2 49.87,80.27 51.54,81.94 JP2.5 52.43,81.92 55.84,81.92 | C61.1 55.84,82.36 55.84,81.92 | 55.84,81.92 ESD26.2
  VCC 0.15: v104.57,63.97 104.6,64 104.6,66.9 103.6,67.9 95.2,67.9 83.8,79.3 59.9,79.3 57.26,81.94 JP2.5
ADC_5  (via drill 0.25)
  Top 0.15: J15.6 106.4,65.77 v106.4,64.1
  Top 0.406: R80.2 48.77,81.61 48.77,83.57 49.68,84.48 JP2.6 52.52,84.37 55.82,84.37 55.83,84.36 ESD25.2 55.92,83.88 55.92,84.37 56.02,84.47 C62.1
  VCC 0.15: v106.4,64.1 106.4,66.3 104.2,68.5 95.3,68.5 84.1,79.8 60.7,79.8 56.02,84.48 JP2.6
BT-RXD/UART2-RX
  Top 0.15: ESD31.2 9.18,79.96 9.2,79.98 | J5.49 86.33,84.67 77.9,93.1 48.6,93.1 44.7,89.2 12.5,89.2 7.6,84.3 | 7.6,84.3 4.21,84.3 JP3.1 | 7.6,84.3 8.5,84.3 9.2,83.6 9.2,81.22 R84.1
  Top 0.406: R84.1 ESD31.2
BT-TXD/UART2-TX
  Top 0.15: J5.50 87.13,84.67 78.1,93.7 48.3,93.7 44.3,89.7 12.1,89.7 7.9,85.5 2.7,85.5 2.3,85.1 2.3,82.8 3,82.1 3.87,82.1 JP3.2 5.28,81.82 6.5,80.6 6.5,79.6 7.3,78.8 9.12,78.8 ESD32.2 9.1,78.7
CAM-F-RESET#/GPIO18  (via drill 0.25)
  Top 0.15: J3.19 v78.6,46.7 | v79.1,71.5 79.1,74.8 78.9,75 65.9,75 v63.3,72.4 | v46.6,76.3 47.36,76.3 R85.1
  Bottom 0.15: v79.1,71.5 79.1,61.3 78.5,60.7 78.5,59.9 78.7,59.7 78.7,46.8 v78.6,46.7 | v63.3,72.4 54.4,72.4 54,72.85 47.55,72.85 46.6,73.8 v46.6,76.3
CAM-F-STBY-EN/GPIO21  (via drill 0.25)  (1 unrouted)
  Top 0.15: J3.6 v71.1,57.1 | v30.9,65.7 19.6,65.7 v17.6,63.7
  Top 0.305: 4.17,62.5 4.9,62.5 6,61.4 7.88,61.4 ESD17.2
  Bottom 0.15: v71.1,57.1 71.1,57 72.2,55.9 72.2,28.7 71.4,27.9 59.3,27.9 58.8,28.4 58.8,47.1 55.8,50.1 50.2,50.1 49.4,50.9 49.4,62.2 45.4,66.2 31.4,66.2 v30.9,65.7 | 4.17,62.5 JP4.1 | v17.6,63.7 12.4,63.7 11.2,62.5 4.2,62.5
  Bottom 0.406: 4.17,62.5 4.2,62.5
CAM-PWR-EN/GPIO19  (via drill 0.25)
  Top 0.15: J3.3 v70.3,59.5 | v45.9,77.6 47.36,77.6 R83.1
  Bottom 0.15: v45.9,77.6 45.9,73.9 49,70.6 59.5,70.6 60.6,69.5 60.6,61.5 62.6,59.5 v70.3,59.5
CAM-R-STBY-EN/GPIO20  (via drill 0.25)
  Top 0.15: J3.5 v70.3,57.9 | v45.3,75.1 47.38,75.1 R86.1
  Bottom 0.15: v70.3,57.9 63.6,57.9 60.2,61.3 60.2,69 59,70.2 48.6,70.2 45.3,73.8 v45.3,75.1
CAM_1V8  (via drill 0.6)
  Top 0.15: 81.7,5.57 C43.1
  Top 0.23: J10.P$7 86.49,7.09 86.23,6.83 84.35,6.83 83.48,5.96 C44.2 | 82.29,5.96 C43.1 82.06,5.21 | 78.77,33.42 C14.1
  Top 0.406: U3.5 78.77,33.42 79.58,33.42 80.4,32.6 v80.4,29.5 | v81.7,7.3 81.7,5.57 | 82.06,5.21 C44.2
  Bottom 0.406: v80.4,29.5 80.4,29.1 80.8,28.6 80.8,8.2 v81.7,7.3
CAM_3V
  Top 0.15: 84.55,10.17 84.57,10.17 | J10.P$3 85.69,8.08 85.82,8.21
  Top 0.2: J10.P$3 J10.P$5
  Top 0.23: R54.2 84.73,4.06 84.81,3.98 85.85,3.98 R55.2 | C42.1 83.11,10.48 83.09,10.5
  Top 0.406: C18.1 75.8,13.24 | 75.8,11.61 FB1.2 | 84.55,10.6 84.55,11.21 83.74,12.02 81.58,12.02 80.9,12.7 80.9,16.8 81,16.9 | 84.55,10.6 84.55,10.17 | 85.82,8.21 85.82,8.92 84.57,10.17 | C42.1 84.43,10.48 84.55,10.6 | R55.2 84.84,4.04 84.8,4 84.8,3 83.6,1.8 75.3,1.8 71.9,5.2 71.9,10.3 73.2,11.6 FB1.2 | 75.71,11.7 FB1.2
  Top 0.61: C17.1 C18.1 | 75.8,13.24 75.8,11.61 | R57.1 R56.1
  Top 0.813: R57.1 81.93,16.27 81.3,16.9 81,16.9 76.6,16.9 75.82,16.12 C17.1
CSI0-D0  (via drill 0.25)
  Top 0.15: 93.15,16.4 v93.15,17.22 | v87.1,64.01 87.1,65.77 J5.1
  Top 0.254: R46.1 92.96,16.29 92.95,16.3 93.05,16.3 93.15,16.4
  Bottom 0.15: v87.1,64.01 87.1,62 89.9,59.2 89.9,19 90.3,18.6 91.77,18.6 v93.15,17.22
CSI0-D1  (via drill 0.25)
  Top 0.15: R47.1 v91.89,17.19 | v86.35,63.34 86.35,65.78 J5.2
  Bottom 0.15: v86.35,63.34 86.35,62.15 89.5,59 89.5,18.7 90,18.2 90.98,18.2 v91.89,17.19
CSI0-D2  (via drill 0.25)
  Top 0.15: R48.1 v90.68,17.16 | v85.55,63.97 85.55,64.99 85.56,65 85.56,65.77 J5.3
  Bottom 0.15: v85.55,63.97 85.57,63.95 85.57,62.23 89.1,58.7 89.1,18.4 89.7,17.8 90.04,17.8 v90.68,17.16
CSI0-D3  (via drill 0.25)
  Top 0.15: R49.1 v89.48,17.21 | v84.75,63.08 84.75,65.78 J5.4
  Bottom 0.15: v84.76,63.07 v84.75,63.08 84.73,63.06 84.73,62.47 88.7,58.5 88.7,17.99 v89.48,17.21
CSI0-D4  (via drill 0.25)
  Top 0.15: R50.1 v88.28,17.21 | v83.92,63.85 J5.5
  Bottom 0.15: v83.92,63.85 83.92,62.61 88.28,58.25 v88.28,17.21
CSI0-D5  (via drill 0.25)
  Top 0.15: J5.6 v83.13,63.11 v83.12,63.1 | v87.09,17.17 87.09,16.29 R51.1
  Bottom 0.15: v83.12,63.1 83.11,62.79 87.9,58 87.9,17.98 v87.09,17.17
CSI0-D6  (via drill 0.25)
  Top 0.15: J5.7 v82.33,63.86 | v85.88,17.19 85.88,16.28 R52.1
  Bottom 0.15: v82.33,63.86 82.31,63.84 82.31,62.89 87.5,57.7 87.5,18.2 87.2,17.9 86.59,17.9 v85.88,17.19
CSI0-D7  (via drill 0.25)
  Top 0.15: J5.8 v81.53,63.12 | v84.65,17.18 R53.1
  Bottom 0.15: v81.53,63.12 81.53,63.07 87.1,57.5 87.1,18.6 86.8,18.3 85.77,18.3 v84.65,17.18
CSI0-HSYNC  (via drill 0.25)
  Top 0.15: J10.P$15 88.09,9.86 88.34,10.11 v93.02,10.11 | v91.95,63.32 91.95,65.78 J15.24
  Bottom 0.15: v93.02,10.11 94.2,11.29 94.2,18.7 91.7,21.2 91.7,63.07 v91.95,63.32
CSI0-MCLK  (via drill 0.25, 0.25 pad 0.5)
  Top 0.15: J15.23 92.8,65.77 v92.8,64 | R64.1 89.52,3.18 90.1,2.6 93.3,2.6 93.8,3.1 93.8,9.1 v94.5,9.8
  Bottom 0.15: v92.8,64 92.8,21.6 95.2,19.2 95.2,10.5 v94.5,9.8
CSI0-PCLK  (via drill 0.25, 0.25 pad 0.5)
  Top 0.15: J15.22 v93.57,63.35 | v92.31,4.01 R63.1
  Bottom 0.15: v92.31,4.01 95.9,7.6 95.9,19.6 93.57,21.93 v93.57,63.35
CSI0-VSYNC  (via drill 0.25, 0.25 pad 0.5)
  Top 0.15: v92.5,11.6 91.4,10.5 88.2,10.5 87.7,9.9 J10.P$13 | J15.25 v91.17,63.95
  Bottom 0.15: v92.5,11.6 93.8,12.9 93.8,18.5 91.3,21 91.3,63.8 91.17,63.93 v91.17,63.95
D0_N  (1 unrouted)
  Top 0.15: J15.17 97.57,64.41 97.37,64.21 97.37,61.08 100.48,57.97 100.48,42.33 83.97,25.82 63.07,25.82 53.87,16.62 52.8,16.62 | L3.1 30.93,15.97 30.7,16.2 30.7,16.5 30.82,16.62 53.9,16.62
D0_P
  Top 0.15: J15.18 96.77,64.41 96.97,64.21 96.97,60.98 100.12,57.83 100.12,42.47 83.83,26.18 62.93,26.18 53.73,16.98 30.58,16.98 30.3,16.7 30.3,16.1 30.1,15.9 30.1,15.8 L3.2
D1_N  (via drill 0.25)
  Top 0.15: J15.15 99.17,64.38 98.97,64.18 98.97,62.53 101.1,60.4 101.55,60.4 v101.74,60.59 | v127.64,37.78 127.4,37.54 127.4,36.34 L4.1
  Bottom 0.15: v127.64,37.78 127.64,38.02 127.4,38.26 127.4,59.25 126.35,60.3 121.9,60.3 102.3,60.3 102.01,60.59 v101.74,60.59
D1_P  (via drill 0.25)
  Top 0.15: J15.16 98.37,64.38 98.57,64.18 98.57,62.33 100.9,60 101.32,60 v101.76,59.56 | v126.77,37.77 127,37.54 127,36.34 L4.2
  Bottom 0.15: v126.77,37.77 126.77,38.03 127,38.26 127,59.15 126.25,59.9 102.3,59.9 101.96,59.56 v101.76,59.56
D2_N  (via drill 0.25)
  Top 0.15: L2.1 93.68,81.41 93.88,81.21 93.88,80.87 v93.58,80.57 | J15.13 100.77,64.39 100.56,64.18 100.56,63 101,62.56 101.48,62.56 v101.58,62.66
  Bottom 0.15: v101.58,62.66 101.84,62.66 102,62.5 109.11,62.5 110.1,63.48 110.1,67.92 107.02,71 103.32,71 96.22,78.1 94.5,78.1 93.9,78.7 93.9,80.25 v93.58,80.57
D2_P  (via drill 0.25)
  Top 0.15: L2.2 94.48,81.41 94.28,81.21 94.28,80.86 v94.57,80.57 | J15.14 99.97,64.37 100.16,64.18 100.16,62.84 100.72,62.28 100.98,62.02 101.26,62.02 v101.58,61.7
  Bottom 0.15: v101.58,61.7 101.6,61.7 102,62.1 109.29,62.1 110.5,63.32 110.5,68.08 107.18,71.4 103.48,71.4 96.38,78.5 94.7,78.5 94.3,78.9 94.3,80.2 v94.57,80.57
DC_5V  (via drill 0.25, 0.4, 0.6, 0.61, 0.7, 0.8)  (1 unrouted)
  Top 0.15: J3.32 64.7,46.65 64.7,46.64 J3.30 | J3.32 J3.31 | J3.31 J3.30 | J3.30 J3.29 v63,44.3 | J3.27 J3.28 v63,43.5 | J3.27 J3.26 v63,41.9 | J3.32 v63,46.7 | J3.31 v63,45.9 | J3.30 v63,45.1 | J3.27 v63,42.7 | v63,41.1 v63.9,41.1 | v64.8,41.1 v65.7,41.1
  Top 0.305: 121.07,86.53 D8.+
  Top 0.406: Q2.2 R13.2 | Q1.2 26.49,24.4 R4.1 R3.1 | U1.1 105.45,90.31 105.45,91.4 105.75,91.7 107,91.7 107.33,92.03 U1.4 | R6.1 96.22,78.99 U2.3 | 107.5,93.06 U1.4 | 107.33,94.6 C7.1 107.3,92.92 U1.4
  Top 0.61: C19.1 67.49,34.61 66.7,35.4 66.7,37.37 C20.+ 66.73,40.07 v65.7,41.1 | R3.1 26.5,26.63 | FB6.2 128.86,63.16 130.6,64.9 130.6,87.7 129.5,88.8 120.9,88.8 120.7,89
  Top 0.813: v80,43.9 v79.2,43.1 78.7,42.6 78.7,39.47 C10.1 78.77,39.4 U3.1 | D8.+ 121.1,86.5 121.1,88.6 120.7,89 120,89.7 117.93,89.7 D5.- 115.73,94.58 F1.1
  Top 1.016: R95.1 55.27,59.71 54.5,58.94 JP1.5 | 26.5,31.1 26.5,24.41 26.49,24.4 | v41.8,31.9 v41.8,25.6
  Top 1.27: 115.7,94.55 115.75,94.6 | 52.35,59 JP1.5 | 107.5,94.6 C6.1
  Top 1.5: F1.1 115.75,94.6
  Top 1.8: 26.5,31.1 27.3,31.9 v32.8,31.9 v34.1,31.9 | 42.9,31.9 v41.8,31.9 v40.7,31.9
  Top 2: 52.35,59 50.2,59 44.8,64.4 v42.6,64.4 | 115.75,94.6 v112.6,94.6 v110.9,94.6 v109.4,94.6 107.5,94.6
  VCC 0.15: v63.9,41.1 v64.8,41.1
  VCC 0.813: v63,45.9 v63,46.7 | v65,11.4 v65,12.3 | 51.84,59 52.9,58.94 JP1.5
  VCC 1.016: v41.8,26.6 v41.8,25.6 41.8,23.9 49.1,16.6 62.1,16.6 65,13.7 v65,12.3 v65,10.4
  VCC 1.27: v80,43.9 v79.2,43.1 75.3,39.5 | v63,41.1 63.1,41 65.5,41 | 62,45.6 62.5,45.6 v63,45.1
  VCC 1.8: v63,45.9 v63,45.1 v63,44.3 v63,43.5 v63,42.7 v63,41.1 63,34.6 60.3,31.9 v43,31.9 v41.8,31.9 v40.7,31.9 v34.1,31.9 32.9,31.9 | 62,45.6 58.9,48.7 58.9,57.3 57.2,59 51.84,59
  VCC 2: v63,41.9 v63,42.7 | v63,41.1 65.5,41.1 | 84.2,91.1 84.2,85.4 90.61,78.99 v93.09,78.99 v93.1,79 | 84.2,91.1 84.2,92 86.8,94.6 v112.6,94.6 | 65.5,41 67,39.5 75.3,39.5 | 84.2,91.1 79.8,91.1 76.4,94.5 49.9,94.5 41.2,85.8 41.2,65.8 v42.6,64.4 v44.1,64.4
  other vias: 92,79
  pour Top (no thermals): 107.05,96.8 108.05,96.8 108.05,92.4 107.05,92.4
  pour Top (no thermals): 64.5,12.8 67,12.8 67,9.9 64.5,9.9
  pour Top (no thermals): 62.9,46.8 65.9,46.8 65.9,40.9 62.9,40.9
  pour Top (no thermals): 91.4,79.8 96,79.8 96.5,79.3 98.1,79.3 98.1,78.7 97,77.7 91.9,77.7 91.4,78.2
ECOL  (via drill 0.25)
  Top 0.15: J5.37 v76.73,72.34 v76.72,72.35 | v31.2,45.6 31.2,45.95 U4.1
  Bottom 0.15: v31.2,45.6 31.2,41.8 32.9,40.1 50.7,40.1 54.7,36 54.7,28 57.47,25.23 73.03,25.23 75,27.2 75,66.3 76.72,68.02 v76.72,72.35
ECRS  (via drill 0.25)
  Top 0.15: J5.36 v75.93,71.48 v75.92,71.49 | U4.23 38.81,53 v43.5,53 v43.51,52.99 R35.1
  Bottom 0.15: v43.5,53 45.5,53 46.2,52.3 46.2,48.2 53.1,41.3 53.1,38.2 55.1,36.2 55.1,28.2 57.7,25.6 72.8,25.6 74.6,27.4 74.6,66.5 75.92,67.82 v75.92,71.49
EMDC  (via drill 0.25)
  Top 0.15: J5.32 v72.73,71.6 v72.72,71.61 | v40,55 37.75,55 U4.25
  Bottom 0.15: v40,55 40.2,54.8 45.1,54.8 46.9,53 46.9,48.8 49.7,46 54,46 56.7,43.3 56.7,29 58.59,27.11 71.81,27.11 73,28.3 73,67.9 72.7,68.2 72.7,71.59 v72.72,71.61
EMDIO  (via drill 0.25)
  Top 0.15: J5.33 73.53,72.23 v73.54,72.24 | 37.1,54.85 U4.26 37.03,56 v37.05,56
  Bottom 0.15: v37.05,56 37.9,56 39.5,54.4 44.9,54.4 46.5,52.8 46.5,48.6 49.5,45.6 53.8,45.6 56.3,43.1 56.3,28.8 58.35,26.75 72.05,26.75 73.4,28.1 73.4,72 73.54,72.14 v73.54,72.24
ERXCK
  Top 0.15: J3.50 62.1,61.1 58.3,57.3 58.3,46.8 57,45.5 47.5,45.5 46.5,46.5 46.5,49.8 46.3,50 44.88,50 R34.1
ERXD0
  Top 0.15: U4.21 38.81,52 40.8,52 42,50.8 42,42 43.7,40.3 58.6,40.3 60.3,42 60.3,55.1 62.3,57.1 J3.45
ERXD1
  Top 0.15: J3.44 62.3,56.3 60.7,54.7 60.7,41.8 58.8,39.9 43.5,39.9 41.6,41.8 41.6,50.6 40.7,51.5 38.81,51.5 U4.20
ERXD2
  Top 0.15: U4.19 38.81,51 40.6,51 41.2,50.4 41.2,41.6 43.3,39.5 59,39.5 61.1,41.6 61.1,54.3 62.3,55.5 J3.43
ERXD3
  Top 0.15: U4.18 38.81,50.5 40.5,50.5 40.8,50.2 40.8,41.4 43.1,39.1 59.2,39.1 61.5,41.4 61.5,53.9 62.3,54.7 J3.42
ERXDV  (via drill 0.25)
  Top 0.15: J5.31 v71.93,71.01 v71.92,71.02 | U4.22 41.57,52.53 v41.9,52.2
  VCC 0.15: v41.9,52.2 41.9,55.2 v42.1,55.4
  Bottom 0.15: v42.1,55.4 45.1,55.4 47.3,53.2 47.3,49 49.9,46.4 54.2,46.4 57.1,43.5 57.1,29.2 58.83,27.47 71.58,27.47 72.6,28.49 72.6,67.3 71.9,68 71.9,71 v71.92,71.02
ERXERR  (via drill 0.25)
  Top 0.15: J5.30 71.13,70.87 70.8,71.2 66.7,71.2 65.3,69.8 v65.3,66 | U4.24 38.81,53.5 39.6,53.5 39.8,53.7 49.6,53.7 51,55.1 54.4,55.1 v61.7,62.4
  Bottom 0.15: v65.3,66 v61.7,62.4
ETXCK  (via drill 0.25)
  Top 0.15: J5.35 v75.13,72.33 | R30.1 32.11,40.39 32.1,40.38 32.1,38.9 33.8,37.2 v55.1,37.2
  Bottom 0.15: v55.1,37.2 55.5,36.8 55.5,28.4 57.85,26.05 72.65,26.05 74.2,27.6 74.2,66.7 75.1,67.6 75.1,72.3 v75.13,72.33
ETXD0  (via drill 0.25)
  Top 0.15: J3.49 62.1,60.3 58.7,56.9 58.7,42.6 58,41.9 48.1,41.9 v46.6,43.4 | v34.7,48.3 34.5,48.1 34.5,46.81 U4.6
  Bottom 0.15: v46.6,43.4 35.1,43.4 34.5,44 34.5,48.1 v34.7,48.3
ETXD1  (via drill 0.25)
  Top 0.15: J3.48 62.1,59.5 59.1,56.5 59.1,42.5 58.1,41.5 47.9,41.5 46.8,42.6 v45.8,42.6 | v34,49 34,46.81 U4.5
  Bottom 0.15: v45.8,42.6 34.7,42.6 34,43.3 v34,49
ETXD2  (via drill 0.25)
  Top 0.15: J3.47 62.1,58.7 59.5,56.1 59.5,42.4 58.2,41.1 47.7,41.1 47,41.8 v45,41.8 | v33.2,48.3 33.5,48 33.5,46.81 U4.4
  Bottom 0.15: v45,41.8 34.3,41.8 33.5,42.6 33.5,48 v33.2,48.3
ETXD3  (via drill 0.25)
  Top 0.15: J3.46 62.25,57.9 59.91,55.56 59.91,42.21 58.4,40.7 44.5,40.7 v44.2,41 | 33,46.75 U4.3 33,46.81 33,45.6 v32.8,45.4
  Bottom 0.15: v44.2,41 34,41 32.8,42.2 v32.8,45.4
ETXEN  (via drill 0.25)
  Top 0.15: J5.34 v74.33,71.47 | v32.5,49.1 32.5,46.81 U4.2 | v54,44.1 v47.3,44.1
  Bottom 0.15: v32.5,49.1 32.5,49.4 32.7,49.6 35.4,49.6 40.9,44.1 v47.3,44.1 | v54,44.1 54.7,44.1 55.9,42.9 55.9,28.6 58.12,26.38 72.28,26.38 73.8,27.9 73.8,70.94 v74.33,71.47
ETXERR  (via drill 0.25)
  Top 0.15: J5.38 v77.53,71.49 | v55.6,25.7 58.1,28.2 v58.1,38 | v48.5,58.5 46.76,58.5 R36.1
  Bottom 0.15: v58.1,38 58.1,43.1 54.4,46.8 50.2,46.8 48.9,48.1 48.9,58.1 v48.5,58.5 | v55.6,25.7 56.51,24.79 73.19,24.79 75.4,27 75.4,66.1 77.53,68.23 v77.53,71.49
GND  (via drill 0.25, 0.25 pad 0.41, 0.25 pad 0.5, 0.3, 0.35, 0.4, 0.5, 0.5 pad 0.5, 0.6)
  Top 0.15: v118.75,76.62 U7.8 U7.3 v116.12,76.62 | U8.8 v118.76,73.51 | U6.3 U6.8 | v118.76,79.72 118.78,79.7 | ESD17.1 ESD22.1 | J15.21 J15.30 | J3.34 J3.33 J3.39 | S2.1 16.44,94.96 16.8,94.6 18.85,94.6 ESD6.1 | S1.1 22.64,94.96 23,94.6 25,94.6 ESD5.1 | S5.1 28.84,94.96 29.2,94.6 31.16,94.6 ESD9.1 | S3.1 35.04,95.66 36,94.7 37.45,94.7 ESD7.1 | S4.1 41.34,95.06 41.8,94.6 43.7,94.6 ESD8.1 | 9.62,17.56 10.74,17.56 C69.2 | ESD13.1 ESD12.1 ESD10.1 103.06,20.99 C56.1 | ESD41.1 2.28,7.12 1.7,7.7 1.7,9.69 ESD39.1 | Y1.2 28.03,46.73 v28.4,47.1 | U4.29 35.53,56.07 v35.2,56.4 | X1.11 X1.10 | 94.37,75.23 94.1,75.5 | ESD30.1 57.21,84.95 | 57.21,84.95 C62.2 | 57.21,84.95 57.21,88.11 57.7,88.6 60.4,88.6 62.4,86.6 63.9,86.6 66.5,84 66.72,84 X1.4 67.01,82.44 X1.5 | C49.2 122.72,57.59 C47.2 120.34,57.82 C48.2 | C35.1 C33.1 81.94,78.56 83.4,77.1 83.4,75.6 v83.3,75.5 | J10.P$24 v90.8,11.7 | J12.6 101.68,16.42 102.2,15.9 102.2,15.1 102.9,14.4 108.8,14.4 v109.5,15.1 | J10.P$2 v84.8,12.2 | C29.1 46.62,60.28 45,61.9 40.7,61.9 39.7,60.9 39.7,59.45 R33.2 | J10.P$19 88.89,8.89 89,9 89.7,9 J10.P$23 | 90.7,82.8 90.72,82.78 ESD2.1 92.16,83.1 95.89,83.1 ESD1.1 98.32,82.77 C36.2 | 28.82,15.11 27.8,15.11 C39.2 | ESD4.1 31.57,15.07 31.3,14.8 29.11,14.8 ESD3.1
  Top 0.2: C23.2 33.65,56.62 33.47,56.44 v33.3,56.44 33.02,56.44 32.52,55.94 U4.35 | R74.1 118.87,67.49 118.89,67.47 120.5,67.47 J11.P$1
  Top 0.23: C43.2 83.13,3.77 C44.1 83.42,4.11 83.39,4.14 | 77.55,33.3 C14.2 | R17.1 74.25,37.67 74.32,37.74 | C10.2 77.62,39.59 77.7,39.67
  Top 0.254: U4.35 | C30.2 26.92,41.04 26.32,41.64 26.32,43.13 | 26.32,43.13 Y1.4 | 26.32,43.13 Y1.4 26.37,43.19 24.87,43.19 24.62,43.44 24.62,43.94 C31.2 | ESD14.1 ESD15.1 ESD10.1 ESD11.1 | C36.2 98.45,84.5 C37.2 | J7.6 87.47,90.02 87.45,90 | J11.2 122.93,80.46 123.08,80.31 123.08,78.91 | 123.08,78.91 123.08,77.38 | J11.17 | J11.5 123.03,78.96 123.08,78.91 | J11.8 123,77.47 123.08,77.38 | J11.11 123.08,75.97 123.08,77.38 | J10.P$1 85.25,7.9 83.8,7.9 83.19,8.51 C42.2 | C44.1 83.16,3.8 82.4,3.8 | C22.2 46.48,56.93 | 46.48,56.93 C21.2 | 46.48,56.93 44.67,56.93 42.2,59.4 39.71,59.4 R33.2 39.54,59.29 C28.2 38.29,59.47 C27.1 | C26.2 27.9,59.1 27.6,58.8 27.6,57.1 v28.6,56.1 | R42.1 24.47,50.2 v23.5,50.2 | v23.5,53.9 23.53,53.87 R43.1 | JP1.6 JP1.7
  Top 0.3: U8.3 v116.11,73.51 | v118.76,73.51 116.92,73.51 | v116.12,79.72 U6.8 v118.76,79.72 | 110.9,45.9 J4.31 | J4.36 110.9,49.9 | J4.41 110.8,53.9 110.9,54 | J4.50 110.8,61.1 110.9,61 110.9,60.3 | 110.9,60.3 110.9,60.1 | J4.49 110.9,60.3 | C45.1 C46.1 | J11.17 123.73,72.97 v124.1,72.6 | C4.2 110.16,85.72 C5.2
  Top 0.305: ESD24.1 10.01,40 v11.8,40 | U2.2 98.66,79.94 99,79.6 99,76.9 97.6,75.5 94.1,75.5 92,75.5 90.7,76.8 90.7,82.8 90.7,87.26 | C31.2 24.58,42.22 v24.6,42.2 | J1.5 J1.4 9.7,26.95 C8.2 | C40.2 123.13,33.04 C41.2 | v112.7,34.8 112.72,34.82 T3.E 112.7,36.02 112.7,39.2 110.9,41 110.9,45.9 110.9,49.9 110.9,54 110.9,60.1 | C42.2 | J5.25 67.93,65.1 | 67.93,65.1 67.93,64.83 67.9,64.8 | v66.9,65.1 67.93,65.1 | X1.11 64.94,76.34 64.9,76.3 | 57.21,84.95 57.21,71.21 57.2,71.2 | SV1.2 40.18,5.18 40.8,5.8 42.17,5.8 ESD44.1 ESD43.1 | X3.9 v129,46.01 v129,47.51 | v129,47.51 v129,49.01 | v129,49.01 v129,50.51 | v129,50.51 v129,52 X3.21 | X3.15 v129,49.01 | X3.18 v129,50.51 | X3.12 v129,47.51 | U4.45 28.13,49.53 26.7,48.1 25.5,48.1 v24.7,47.3 | U4.17 37.37,50.03 36.7,50.7 v36.7,51.5 36.3,50.9 36.3,48.7 37.03,47.97 U4.11 | C27.1 36.85,62.85 35.5,64.2 | 123.08,75.97 123.33,75.97 v124.1,75.2 | 89.7,9 91,9 91.1,9.1 91,9.1 v90.9,9.2 | J8.2 128.82,32.82 v128.9,32.9 | v113.1,27.6 117,31.5 v117,32.9 | 122.99,32.9 v124.5,32.9
  Top 0.406: J12.6 101.7,17.38 101.7,17.35 | ESD16.1 103.06,20.95 C56.1 103.16,20.86 103.2,20.9 | T4.E 66.86,16.36 63.5,13 62.83,13 R19.1 C11.2 | C16.2 | 77.5,6.61 C15.2 | C18.2 76.92,13.26 77.45,13.79 77.45,14.78 C17.2 | C39.2 26.13,14.81 C38.2 | C2.2 23.94,23.47 C3.2 | T2.E 37.71,23.57 38.62,22.66 R7.1 | C68.2 11.98,17.56 9.62,17.56 9.58,17.6 C67.2 9.46,17.51 4.37,17.51 | ESD39.1 2.84,15.98 4.37,17.51 | R8.1 105.65,98.2 105.65,96.34 C6.2 106.19,95.8 C7.2 | U1.2 106.38,88.55 R2.2 107.27,88.53 108.9,86.9 C4.2 | U3.2 77.82,39.25 C10.2 | C9.2 77,40.07 C10.2 | 74.25,37.67 74.25,39.15 74.6,39.5 77.57,39.5 C10.2 | J15.30 94.37,75.23 | J1.6 4.16,17.73 4.37,17.51 | 79.7,80.4 78.63,81.47 C32.1 78.45,82.4 v77,82.4 75.7,81.1 v75.3,81.1 | 79.7,80.4 79.7,79.8 C35.1 | 79.7,80.4 81.8,80.4 v82.3,80.9 | C34.1 79.73,87.27 v78.3,88.7 | C42.2 79.52,9.38 v79.3,9.6 | C45.1 87.12,2.68 88,1.8 93.8,1.8 94.9,2.9 94.9,7 J12.12 | ESD16.1 ESD14.1 | ESD14.1 100.69,20.99 100.7,21 98.5,21 | ESD13.1 104.51,20.99 104.5,21 102.1,21 102,20.9 | ESD10.1 ESD14.1 | ESD16.1 98.13,25.03 99.1,26 109.5,26 v111.1,27.6 v113.1,27.6 | ESD37.1 ESD31.1 11.66,79.96 12.4,80.7 v12.4,83 | C25.2 32.03,60.97 v32,61 | C19.2 74.7,33.51 | 74.7,33.51 77.64,33.51 C14.2 | C13.2 74.7,33.45 74.7,33.51 | J11.P$2 121.25,84.7 120.1,84.7 117.15,87.65 116.68,87.65 D5.+ | 10.5,60.08 v10.5,61.3 | C24.2 33.34,41.34 v33,41 33,39.2 34.3,37.9 37.4,37.9 38.2,38.7 38.2,42.83 R39.1 | R38.1 R39.1 | R39.1 39.12,42.92 39.5,43.3 v39.5,44.3
  Top 0.61: C51.2 11.09,96.74 C50.2 10.49,96.01 U9.2 | ESD17.1 10.5,60.08 v10.5,52.9 | ESD23.1 10,42.47 10,46.1 8.86,47.24 JP4.7 | C20.- 69.24,33.51 C19.2 | 74.25,39.15 72.7,37.5 v70.9,37.5 | C43.2 81.77,3.8 78.7,3.8 77.52,4.98 C15.2 77.52,7.63 77.42,7.73 | C16.2 77.42,7.73 | C18.2 77.42,12.71 77.42,7.73
  Top 1.016: J1.6 4.2,22.7 4.2,27 5.15,27.95 J1.5 5.46,27.95 J1.7
  Top 1.5: 87.45,90 90.45,90 | 90.45,90 100.78,90 J7.5 | J7.4 90.66,89.79 90.45,90
  Bottom 0.15: v118.76,76.63 v118.75,76.62 v118.76,76.61 | v116.11,76.61 v116.12,76.62 | v35.2,56.4 33.34,56.4 v33.3,56.44
  Bottom 0.254: v23.5,50.2 v23.5,53.9
  Bottom 0.3: v118.76,79.72 v118.76,76.63 | v116.12,79.72 v116.12,76.62 | v116.11,73.51 v116.11,76.61 | v118.76,73.51 v118.76,76.61
  Bottom 0.305: v11.8,40 13,41.2 13,45.7 11.4,47.3 4.7,47.3 | 8.5,47.24 8.54,47.2 8.56,47.2 8.6,47.24 | U9.2 6.61,96.01 2.1,91.1 2.1,64.5 1.6,64 1.6,48.6 2.7,47.2 4.11,47.2 JP4.7 | v128.9,32.9 v124.5,32.9 v117,32.9 114.2,32.9 112.7,34.4 v112.7,34.8
  Bottom 0.406: v24.7,47.3 23.8,47.3 23.5,47.6 v23.5,50.2
  Bottom 0.61: JP4.7 4.21,47.3 4.7,47.3 8.6,47.3 10.5,49.2 v10.5,52.9
  other vias: 63.1,50.5 63.1,49.8 63.1,49.1 63.1,48.4 63.1,47.7 1.9,19.1 10.1,6 17.6,9.1 19.5,26.4 21.1,26.4 22.5,26.4 36.1,12 37.9,12 39.7,12 116.3,14.5 116.3,16.6 20.6,34.9 22.5,34.9 24.4,34.9 10.1,35.9 127.8,61.8 129.8,61.8 63.5,70 93.4,72.8 95.5,72.8 36,35.3 38.1,35.3 40.2,35.3 42.3,35.3 35.5,27.5 36.9,27.5 38.3,27.5 46.7,25.6 48.8,25.6 50.9,25.6 10.7,31.3 12.2,31.3 1.9,31.6 1.9,25.4 116.3,38.6 120.7,42.8 104.1,29.1 92.1,7.8 94.9,8.6 108.2,1.3 98.6,1.3 102,1.3 105.3,1.3 41.2,19.4 29.9,20.3 38.6,18.1 44.4,15.3 47.1,12.9 57.7,13.7 59.6,13.7 23.5,11 23.5,6.7 15.2,8.1 19.8,8.7 5.4,4.3 5.1,15.7 5.7,19.2 49.4,97.8 51.4,97.8 53.4,97.8 55.4,97.8 51.1,88 56.3,90.6 58.1,90.6 44.3,84.6 32.6,87.1 34.6,87.1 36.6,87.1 34.2,80.4 35.9,80.4 37.7,80.4 31.4,75.5 32.9,75.5 34.3,75.5 36.1,71.6 37.4,71.6 38.7,71.6 16,58.9 16,55.4 16,51.3 16,48.5 13,48.5 8.1,48.5 11.6,35.9 18.6,83 17.1,83 33.4,91.6 35.4,91.6 37.4,91.6 66.3,97.5 68.3,97.5 70.3,97.5 119.5,54.4 115.9,53.9 115.9,55.9 115.9,58 114.25,67.8 114.2,69.15 89.1,64.4 89.1,70.5 65.3,87.4 70.3,87.4 90.2,97.6 92.2,97.6 94.2,97.6 96.2,97.6 98.2,97.6 127.8,86.3 129.1,86.3 31.3,20.3 29.9,19.1 31.3,19.1 1.2,38.4 1.2,43.9 1.1,47.3 0.8,51.5 0.7,55.6 0.8,59.6 0.8,62.9 1,66.9 0.8,72.4 0.8,76.9 0.8,81 0.8,85 0.8,89 4.9,88 6.9,88 82.8,58 85.2,57 90.2,60.3 95.1,56.4 95.1,51.9 90.6,55 90.6,50.5 95.2,47.8 90.6,46 95.2,44 90.6,42.2 95.2,40.4 90.6,38.4 90.6,34.9 90.6,27.6 86.3,30.1 82.4,27.1 81.7,32.7 94.6,31.7 95.8,33.1 99.9,37.1 101.3,38.5 102.7,39.9 94.7,26.3 95.6,27.2 99.9,31.5 101.3,32.9 102.7,34.3 104.1,35.7 105.5,37.1 94.5,22.8 95.4,23.9 90.6,22.6 90.6,21.9 86.3,23.7 73.3,16.2 72,12.2 79.1,13.4 75.5,3.2 74.4,4.7 77.1,3.2 106.7,45.1 106.7,47.6 106.7,50 106.7,52.3 131.5,61.8 112.4,81.7 113.9,81.7 104.7,82.5 116.6,99.6 118.4,99.6 129,98.9 130.3,98.9 95.2,62.8 104.6,61.2 105.6,61.2 106.6,61.2 82.3,49.1 79.8,49.9 81,51.9 78.4,45.1 80,46.4 81.7,44.3 81.7,41.2 81.7,38.7 81.6,35.8 70.9,36.3 63.3,32.5 63.3,31.2 111.6,64 106.3,78.35 109.55,76.15 109.4,92.9 110.4,92.9 111.5,92.9 39.8,46.5 43.4,45.2 35.5,64.3 38.1,64.3 22.1,63.8 22.1,61.9 107.6,85 124.1,81.9 124.1,80.3 124.1,78.7 124.1,76.9 39.2,38.3 40.9,38.3 42.6,38.3
  pour GND (isolate 0.3, rank 2, no thermals): -2.5,100.6 132.6,100.6 132.6,0 -2.5,0
  pour Bottom (isolate 0.3, rank 2, no thermals): -4.5,100.6 132.6,100.6 132.6,0 -4.5,0
  pour Top (isolate 0.3, rank 2, no thermals): -1.5,100.6 132.6,100.6 132.6,0 -1.5,0
  pour VCC (isolate 0.3, rank 2): -3.5,100.6 132.6,100.6 132.6,0 -3.5,0
  pour Top (no thermals): 62.8,52.5 65.9,52.5 65.9,47.4 62.8,47.4
HCEC  (via drill 0.25)
  Top 0.15: v101.55,74.49 101.55,69.32 | R71.1 112.88,70.52 111.9,71.5 111.9,74.2 112.2,74.5 v114.03,74.5 U8.1 | J11.13 121.12,74.9 119.8,74.9 119.4,74.5 U8.10 U8.1 116.83,74.42
  Top 0.254: 101.55,69.32 J15.39 | U8.1
  Bottom 0.15: v113.36,74.5 v101.56,74.5 v101.55,74.49
  Bottom 0.2: v113.36,74.5 v114.03,74.5
HHPD  (via drill 0.25)
  Top 0.15: v102.36,73.45 J15.40 | v112.59,73.84 v112.6,73.83 112.6,73 113.11,72.49 117.89,72.49 U8.6 | U8.6 118.5,72.52 | 118.5,72.52 119.28,72.52 119.9,71.9 121.12,71.9 J11.19 | R74.2 118.7,72.32 118.5,72.52 | U8.5 U8.6
  Top 0.254: J15.40
  Bottom 0.15: v102.36,73.45 v102.36,73.46 102.4,73.5 102.5,73.5 102.87,73.87 112.56,73.87 v112.59,73.84
HPCOM  (via drill 0.25)
  Top 0.15: 10.77,13.96 10.8,13.93 10.8,13.2 9.6,12 9.6,8.5 8.9,7.8 v6,7.8 4.42,7.8 FB11.2 | J4.43 107.4,55.5 v107,55.1 107,55 105.4,53.4 105.4,38.4 88.2,21.2 78.4,21.2 77.1,19.9 74.1,19.9 v73.2,20.8 | v114.5,55.1 114.85,54.75 R9.1
  Top 0.406: R93.1 10.79,13.98 10.77,13.96
  Bottom 0.15: v107,55.1 107.4,55.5 109.2,55.5 109.6,55.1 v114.5,55.1 | v73.2,20.8 73,20.8 72.7,21.1 9.4,21.1 8.4,20.1 8.4,9 7.2,7.8 v6,7.8
HPCOMB  (via drill 0.25)
  Top 0.15: J4.46 v106.8,57.9 | v114.8,57.2 115.1,56.9 116.8,56.9 117.6,56.1 R9.2
  Bottom 0.15: v106.8,57.9 114.1,57.9 v114.8,57.2
HPL  (via drill 0.25)
  Top 0.15: J4.44 106.9,56.3 106.1,55.5 106.1,54.6 105,53.5 105,38.6 88,21.6 77.76,21.6 v76.7,20.54 | R91.1 9.53,14 7.7,14 | 7.7,14 5.4,14 4.27,12.87 FB13.2 | v7.6,15.6 7.6,14.1 7.7,14
  Bottom 0.15: v76.7,20.54 74.96,20.54 74,21.5 8.8,21.5 7.6,20.3 v7.6,15.6
HPR  (via drill 0.25)
  Top 0.15: J4.45 106.58,57.1 105.7,56.22 105.7,54.7 104.6,53.6 104.6,38.9 87.8,22 76.56,22 v75.88,21.32 | v13.6,22.3 13.6,14.7 12.9,14 12.07,14 R92.1 12.4,13.67 12.4,4.9 13.3,4 18.2,4 19.1,4.9 19.1,5.07 FB12.2
  Bottom 0.15: v75.88,21.32 74.88,21.32 74.3,21.9 14,21.9 v13.6,22.3
HSCL  (via drill 0.25)
  Top 0.15: v103.98,71.95 J15.42 | v114.75,73.72 115.05,74.02 115.05,74.03 115.12,74.1 116.82,74.1 U8.2 U8.9 | U8.9 | 121.11,73.9 120.6,73.9 120.5,74 119.6,74 119.5,74.1 118,74.1 U8.9 | 121.11,73.9 J11.15 | 121.11,73.9 125,73.9 125.6,73.3 125.6,66.68 R73.1
  Top 0.254: J15.42
  Bottom 0.15: v103.98,71.95 104.28,72.25 114.3,72.25 114.75,72.7 v114.75,73.72
HSDA  (via drill 0.25)
  Top 0.15: v103.17,72.89 J15.41 | U8.7 | U8.7 118.3,73 118.4,72.9 119.3,72.9 119.8,73.4 121.12,73.4 J11.16 124.65,73.45 125.1,73 125.1,66.32 R72.1 | U8.7 U8.4 116.7,73 116.62,72.92 113.87,72.92 v113.61,73.18 v113.62,73.18 113.62,73.17
  Top 0.254: J15.41
  Bottom 0.15: v103.17,72.89 103.17,72.91 103.44,73.18 v113.61,73.18
HTX0_N
  Top 0.15: J15.48 108.77,71.07 108.53,71.31 108.53,76.42 109.3,77.19 116.4,77.19 116.46,77.13 116.8,77.13 U7.2 U7.9 118.53,77.13 118.6,77.2 119.4,77.2 119.6,77 121.13,77 J11.9
HTX0_P
  Top 0.15: J15.47 107.97,71.11 108.17,71.31 108.17,76.56 109.16,77.55 116.4,77.55 116.46,77.61 U7.1 U7.10 119.61,77.61 119.9,77.9 121.13,77.9 J11.7
HTX1_N
  Top 0.15: J15.46 107.17,71.06 106.93,71.3 106.93,77.42 108.3,78.79 116.39,78.79 116.45,78.73 U6.5 117,78.73 U6.6 119.47,78.73 119.8,78.4 121.12,78.4 J11.6
HTX1_P
  Top 0.15: J15.45 106.37,71.1 106.57,71.3 106.57,77.56 108.16,79.15 116.39,79.15 116.45,79.21 U6.4 117,79.21 U6.7 118.5,79.2 118.6,79.1 119.5,79.1 119.8,79.4 121.1,79.4 J11.4
HTX2_N
  Top 0.15: J15.44 105.57,71.13 105.34,71.36 105.34,78.48 107.15,80.29 116.38,80.29 116.45,80.23 116.7,80.23 U6.2 U6.9 119.37,80.23 119.6,80 121.13,80 J11.3
HTX2_P
  Top 0.15: J15.43 104.77,71.15 104.98,71.36 104.98,78.62 107.01,80.65 116.38,80.65 116.44,80.71 U6.1 U6.10 119.31,80.71 119.6,81 121.14,81 J11.1
HTXC_N
  Top 0.15: J15.50 110.37,71.06 110.14,71.29 110.14,75.01 110.82,75.69 116.42,75.69 116.48,75.63 U7.5 U7.6 119.67,75.63 119.9,75.4 121.12,75.4 J11.12
HTXC_P
  Top 0.15: J15.49 109.57,71.08 109.78,71.29 109.78,75.15 110.68,76.05 116.42,76.05 116.48,76.11 U7.4 U7.7 118.29,76.11 118.4,76 119.4,76 119.8,76.4 121.12,76.4 J11.10
IR-AP  (via drill 0.25)
  Top 0.15: J5.41 79.93,71.53 80.6,72.2 85.2,72.2 85.6,72.6 85.6,84.6 77.6,92.6 48.9,92.6 44.8,88.5 v31.5,88.5 | R65.2 | v28.4,91.6 7.4,91.6 5.9,93.1 5.9,96.16 U9.1
  Top 0.406: U9.1 R65.2
  Bottom 0.15: U9.1 8.04,98.3 | v28.4,91.6 v31.5,88.5
KEY_BACK  (via drill 0.25)
  Top 0.15: 32.54,96.06 R62.1 | J3.21 v70.3,45.1
  Top 0.305: S5.2 32.54,96.06 | R62.1 32.38,95.9 v30.2,95.9 31.16,95.9 ESD9.2
  Bottom 0.15: v70.3,45.1 69.7,45.1 57,57.8 57,62.3 56.6,62.7 50.6,62.7 45.9,67.4 28.2,67.4 25.1,70.5 25.1,91.9 26.7,93.5 29.1,93.5 30.2,94.6 v30.2,95.9
KEY_HOME  (via drill 0.25)
  Top 0.15: J3.16 v70.2,49.1 | 44.92,96 R61.1
  Top 0.305: R61.1 ESD8.2 42.25,95.95 v42.2,96 | 44.92,96 44.92,97.62 S4.2
  Bottom 0.15: v70.2,49.1 67.8,49.1 58.2,58.7 58.2,67.3 57.3,68.2 29.2,68.2 25.9,71.5 25.9,91.5 27,92.6 41,92.6 42.2,93.8 v42.2,96
KEY_MENU  (via drill 0.25)
  Top 0.15: J3.20 v71.1,45.9
  Top 0.305: S3.2 38.71,97.71 R60.1 38.66,95.9 v36.4,95.9 37.45,95.9 ESD7.2
  Bottom 0.15: v36.4,95.9 36.3,95.8 36.3,93.8 35.5,93 26.8,93 25.5,91.7 25.5,71 28.7,67.8 53.9,67.8 57.3,64.4 57.4,58.1 69.6,45.9 v71.1,45.9
LCD0-D2/USB-EN  (via drill 0.25)
  Top 0.15: v111.4,75.1 111.4,71 112.9,69.5 112.9,64.2 114.4,62.7 114.4,59.7 114.2,59.5 J4.3 | v101.7,77.6 101.7,78.97 R12.1
  Top 0.305: U2.4 R12.1
  Bottom 0.15: v111.4,75.1 111.4,75.9 110.5,76.8 102.5,76.8 v101.7,77.6
LCD1-HSYNC/GPIO22/CSI0-PWR-EN  (via drill 0.25)  (1 unrouted)
  Top 0.15: J10.P$9 86.89,9.22 v86.63,9.48 | J3.10 83.18,53.9
  Top 0.23: J10.P$9 86.89,6.58 86.64,6.33 85.66,6.33 R54.1
  Bottom 0.15: v86.63,9.48 86.63,9.5 86.49,9.64 86.49,13.21 83.3,16.4 83.3,19.7 85,21.4 85,52.1 83.22,53.88 v83.2,53.88
LCD1-HYSN/GPIO22/CSI0-PWR-EN
  Top 0.406: R17.2 U3.3 | U3.3
LCD1-VSYNC/GPIO23/CSI0-RESET#  (via drill 0.25)
  Top 0.15: J10.P$11 87.29,10.23 v87.1,10.42 | J3.11 84.94,53.1 v84.97,53.07
  Top 0.2: J10.P$11 87.29,5.4 C45.2
  Top 0.254: R55.1 87.01,5.34 C45.2
  Bottom 0.15: v87.1,10.42 87.1,13.14 83.68,16.56 83.7,17.04 83.7,19.5 85.4,21.2 85.4,52.6 84.97,53.03 v84.97,53.07
LRADC0  (via drill 0.25)
  Top 0.15: v108,64 108,65.77 J15.4 | v54.8,74 54.8,71.97 54.6,71.77
  Top 0.406: R86.2 48.77,75.01 48.77,72.57 49.56,71.78 JP2.1 54.6,71.77 55.91,71.77 | C57.1 56.07,72.47 55.91,72.31 55.91,71.77 | 55.91,71.77 ESD30.2
  Bottom 0.15: 52.49,71.7 JP2.1 | v54.8,74 55,73.8 99,73.8 105.3,67.6 107.3,67.6 108,66.9 v108,64
LRADC1  (via drill 0.25)
  Top 0.15: v108.8,63.4 108.8,65.77 J15.3 | 56.02,73.88 56.02,74.58 55.85,74.75 52.84,74.75 JP2.2
  Top 0.406: R85.2 48.76,76.32 49.77,76.32 50.37,75.72 50.37,74.67 50.72,74.32 JP2.2 | C58.1 56.02,73.88 ESD29.2 55.92,73.78 55.92,73.87
  Bottom 0.15: 52.43,74.3 JP2.2 53.29,75.2 54.9,75.2 55.8,74.3 99.1,74.3 105.4,68 107.7,68 108.8,66.9 v108.8,63.4
LVDS_TA_N  (via drill 0.25)
  Top 0.15: J4.12 114.07,52.3 114.32,52.55 120.75,52.55 v121,52.3 | X3.23 125.36,53.01 125.3,52.95 124.32,52.95 R66.2 122.5,53.4 v122.2,53.7
  Bottom 0.15: v121,52.3 121.6,52.9 121.6,53.1 v122.2,53.7
LVDS_TA_P
  Top 0.15: J4.11 114.13,53.1 114.32,52.91 123.06,52.91 R66.1 124.38,52.59 125.3,52.59 125.38,52.51 X3.22
LVDS_TB_N
  Top 0.15: J4.14 114.08,50.7 114.3,50.92 119.69,50.92 119.82,50.79 119.82,50.78 119.95,50.65 120.53,50.65 121.07,51.19 121.78,51.19 R67.2 123.01,51.44 125.3,51.44 125.37,51.51 X3.20
LVDS_TB_P  (via drill 0.25)
  Top 0.15: J4.13 114.08,51.5 114.3,51.28 v120.22,51.28 | X3.19 125.37,51.01 125.3,51.08 122.97,51.08 R67.1 | R67.1 | v121.39,50.64 121.39,50.66 121.59,50.86 122.29,50.86 R67.1
  Bottom 0.15: v120.22,51.28 120.75,51.28 v121.39,50.64
LVDS_TC_N
  Top 0.15: J4.16 114.09,49.1 114.31,49.32 119.18,49.32 119.91,50.05 121.53,50.05 121.77,49.81 123.23,49.81 R68.2 124.31,49.95 125.31,49.95 125.37,50.01 X3.17
LVDS_TC_P  (via drill 0.25)
  Top 0.15: J4.15 114.09,49.9 114.31,49.68 118.73,49.68 v119.13,50.08 | X3.16 125.39,49.51 125.31,49.59 124.31,49.59 R68.1 123.48,49.48 v121.2,49.48
  Bottom 0.15: v119.13,50.08 120.6,50.08 v121.2,49.48
LVDS_TCLK_N
  Top 0.15: J4.18 114.02,47.5 114.25,47.73 119.87,47.73 120.75,48.61 121.43,48.61 121.59,48.45 122.07,48.45 R69.2 | X3.14 125.37,48.51 125.3,48.44 122.98,48.44 R69.2 | 122.23,48.61 R69.2
LVDS_TCLK_P  (via drill 0.25)